# Altium project Apalis-Smart-Vision-Baseboard-Rev.1.2.1.PrjPcb (part 1 of 2)
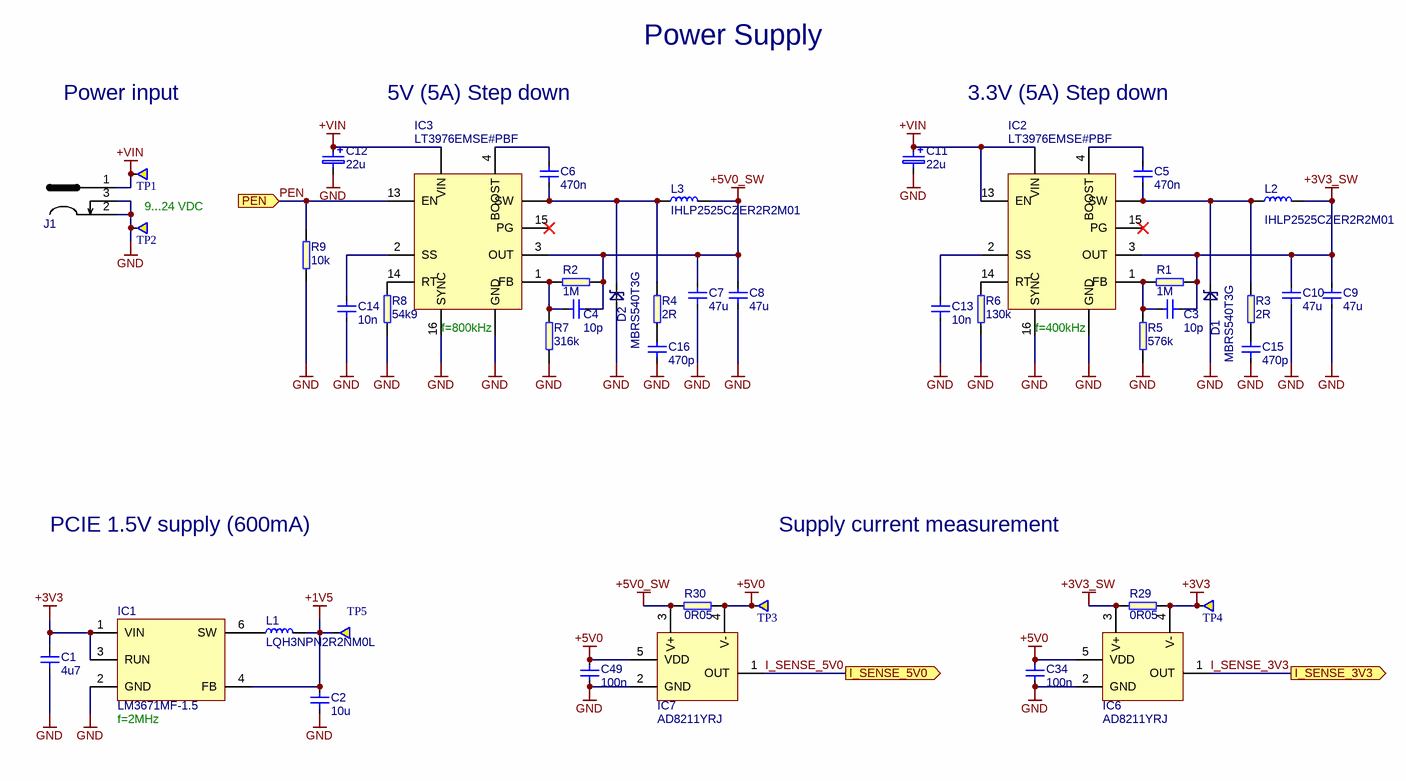
[diagram p0: Power-Supply.SchDoc]
AM_Title: Apalis Smart Vision Baseboard; AM_Status: OSHW; AM_Revision: 1.2.1
9 sheets, 202 parts. Net scope: global (net labels, ports and power ports of the same name join across sheets).
Board file: Apalis-Smart-Vision-Baseboard.PcbDoc
Sheets:
  Power-Supply.SchDoc
  SoM-Supply.SchDoc
  SoM-HighSpeed.SchDoc
  SoM-LowSpeed.SchDoc
  PCIe-SATA.SchDoc
  Debug-UART.SchDoc
  Camera-Interface.SchDoc
  Peripherals.SchDoc
  Interfaces.SchDoc

## Sheet Power-Supply.SchDoc
size A3; DocumentNumber: 1; SheetNumber: 1; SheetTotal: 9; PageSetup: Record=PageOptions|CenterHorizontal=True|CenterVertical=True|PrintScale=0.97|XCorrection=1.00|YCorrection=1.00|PrintKind=1|BorderSize=5000000|LeftOffset=0|BottomOffset=0|Orientation=2|PaperLength=2970|PaperWidth=2100|Scale=100|PaperSource=7|PrintQuality=600|MediaType=1|DitherType=10|PaperKind=A4|PrintScaleMode=1

### Parts
C1  4u7  [0402]
C2  10u  [0603]
C3  10p  [0402]
C4  10p  [0402]
C5  470n  [0402]
C6  470n  [0402]
C7  47u  [1206]
C8  47u  [1206]
C9  47u  [1206]
C10  47u  [1206]
C11  22u  [KEMET_C]
C12  22u  [KEMET_C]
C13  10n  [0402]
C14  10n  [0402]
C15  470p  [0402]
C16  470p  [0402]
C34  100n  [0402]
C49  100n  [0402]
D1  MBRS540T3G  [SMC-403-03]
D2  MBRS540T3G  [SMC-403-03]
IC1  LM3671MF-1.5  [SOT23-5N]
IC2  LT3976EMSE#PBF  [LT3976EMSE]
IC3  LT3976EMSE#PBF  [LT3976EMSE]
IC6  AD8211YRJ  [SOT23-5]
IC7  AD8211YRJ  [SOT23-5]
J1  694106106102  [694106106102]  (value not drawn)
L1  LQH3NPN2R2NM0L  [LQH3NPN2R2NM]
L2  IHLP2525CZER2R2M01  [IHLP-2525CZ-01]
L3  IHLP2525CZER2R2M01  [IHLP-2525CZ-01]
R1  1M  [0402]
R2  1M  [0402]
R3  2R  [0402]
R4  2R  [0402]
R5  576k  [0402]
R6  130k  [0402]
R7  316k  [0402]
R8  54k9  [0402]
R9  10k  [0402]
R29  0R05  [1206]
R30  0R05  [1206]
TP1  TP-R-1.5  [TP-R-1.5]  (value not drawn)  (no BOM)
TP2  TP-R-1.5  [TP-R-1.5]  (value not drawn)  (no BOM)
TP3  TP-R-1.5  [TP-R-1.5]  (value not drawn)  (no BOM)
TP4  TP-R-1.5  [TP-R-1.5]  (value not drawn)  (no BOM)
TP5  TP-R-1.5  [TP-R-1.5]  (value not drawn)  (no BOM)

### Ports
I_SENSE_3V3 (out), I_SENSE_5V0 (out), PEN (in)

### Nets
+1V5: C2.2 IC1.4(FB) L1.2 TP5.1
+3V3: C1.2 IC1.1(VIN) IC1.3(RUN) IC6.4(V-) R29.1 TP4.1
+3V3_SW: C3.1 C9.2 C10.2 IC2.3(OUT) IC6.3(V+) L2.2 R1.1 R29.2
+5V0: C34.1 C49.1 IC6.5(VDD) IC7.4(V-) IC7.5(VDD) R30.1 TP3.1
+5V0_SW: C4.1 C7.2 C8.2 IC3.3(OUT) IC7.3(V+) L3.2 R2.1 R30.2
+VIN: C11.1 C12.1 IC2.13(EN) IC2.VIN IC3.VIN J1.1 TP1.1
GND: C1.1 C2.1 C7.1 C8.1 C9.1 C10.1 C11.2 C12.2 C13.1 C14.1 C15.1 C16.1 C34.2 C49.2 D1.A D2.A IC1.2(GND) IC2.16(SYNC) IC2.GND IC3.16(SYNC) IC3.GND IC6.2(GND) IC7.2(GND) J1.2 J1.3 R5.1 R6.1 R7.1 R8.1 R9.1 TP2.1
I_SENSE_3V3: IC6.1(OUT) ; port I_SENSE_3V3
I_SENSE_5V0: IC7.1(OUT) ; port I_SENSE_5V0
PEN: IC3.13(EN) R9.2 ; port PEN
NetC3_2: C3.2 IC2.1(FB) R1.2 R5.2
NetC4_2: C4.2 IC3.1(FB) R2.2 R7.2
NetC5_1: C5.1 D1.C IC2.SW L2.1 R3.2
NetC5_2: C5.2 IC2.4(BOOST)
NetC6_1: C6.1 D2.C IC3.SW L3.1 R4.2
NetC6_2: C6.2 IC3.4(BOOST)
NetC13_2: C13.2 IC2.2(SS)
NetC14_2: C14.2 IC3.2(SS)
NetC15_2: C15.2 R3.1
NetC16_2: C16.2 R4.1
NetIC1_6: IC1.6(SW) L1.1
NetIC2_14: IC2.14(RT) R6.2
NetIC3_14: IC3.14(RT) R8.2

Not connected (* = marked no-connect by the designer): IC2 15(PG)*; IC3 15(PG)*

### Notes on the sheet
- Power Supply
- Power input
- 5V (5A) Step down
- 3.3V (5A) Step down
- (near TP2) 9...24 VDC
- (near IC3) f=800kHz
- (near IC2) f=400kHz
- PCIE 1.5V supply (600mA)
- Supply current measurement
- (near IC1) f=2MHz
- Title:
- Size:
- Date:
- A3
- Revision:
- Page:
- of
- Antmicro Ltd.
- File:
- www.antmicro.com

### Library data of the parts
C1 = C_4u7_0402: MLCC SMT Capacitor 4.7uF 0402; Manufacturer: MURATA; Part Symbol: GRM155R60G475ME; Value: 4u7; Part Number: C_4u7_0402; MPN: GRM155R60G475ME
C2 = C_10u_0603: MLCC SMT Capacitor 10uF 0603; Manufacturer: Walsin; Part Symbol: 0603X106M6R3CT; Value: 10u; Part Number: C_10u_0603; MPN: 0603X106M6R3CT
C3 C4 = C_10p_0402: MLCC SMT Capacitor 10pF 0402; Manufacturer: MULTICOMP; Part Symbol: MC0402N100D500CT; Value: 10p; Part Number: C_10p_0402; MPN: MC0402N100D500CT
C5 C6 = C_470n_0402: MLCC SMT Capacitor 470n 0402; Manufacturer: TDK; Part Symbol: MC0402X474K6R3CT; Value: 470n; Part Number: C_470n_0402; MPN: MC0402X474K6R3CT
C7-C10 = C_47u_1206: MLCC SMT Capacitor 47uF 1206; Manufacturer: MURATA; Part Symbol: GRM31CC80J476KE18L; Value: 47u; Part Number: C_47u_1206; MPN: GRM31CC80J476KE18L
C11 C12 = C_22u_KEMET_C: Tantalum SMT Capacitor 22uF Case KEMET_C; Manufacturer: KEMET; Part Symbol: T491C226K025AT; Value: 22u; Part Number: C_22u_KEMET_C; MPN: T491C226K025AT
C13 C14 = C_10n_0402: MLCC SMT Capacitor 10 nF 0402; Manufacturer: AVX; Part Symbol: 04025G103ZAT2A; Value: 10n; Part Number: C_10n_0402; MPN: 04025G103ZAT2A
C15 C16 = C_470p_0402: MLCC SMT Capacitor 470pF 0402; Manufacturer: MULTICOMP; Part Symbol: MC0402B471J500CT; Value: 470p; Part Number: C_470p_0402; MPN: MC0402B471J500CT
C34 C49 = C_100n_0402: MLCC SMT Capacitor 100n 0402; Manufacturer: TDK; Part Symbol: C1005X5R0J104K050BA; Value: 100n; Part Number: C_100n_0402; MPN: C1005X5R0J104K050BA
D1 D2 = MBRS540T3G: ON SEMICONDUCTOR  MBRS540T3G  Rectifier Diode, Single, 40 V, 5 A, 500 mV, 190 A, 150 °C; Part Number: MBRS540T3G; Value: MBRS540T3G; Manufacturer: ON SEMICONDUCTOR; Part Symbol: MBRS540T3G; MPN: MBRS540T3G
IC1 = LM3671: DC/DC Buck Converter; Manufacturer: TEXAS INSTRUMENTS; Part Symbol: LM3671MF-1.5/NOPB; Part Number: LM3671MF-1.5; Value: LM3671MF-1.5; MPN: LM3671MF-1.5/NOPB
IC2 IC3 = LT3976: LINEAR TECHNOLOGY  LT3976EMSE#PBF  DC-DC CONVERTER, 2MHZ, 5A, MSOP-16; Part Number: LT3976EMSE#PBF; Value: LT3976EMSE#PBF; Manufacturer: LINEAR TECHNOLOGY; Part Symbol: LT3976EMSE#PBF; MPN: LT3976EMSE#PBF
IC6 IC7 = AD8211YRJ: Current Sense Amplifier, High Voltage, 1 Amplifier, SOT-23, 5 Pins, -40 °C, 125 °C; Manufacturer: ANALOG DEVICES; Part Symbol: AD8211YRJ; Value: AD8211YRJ; MPN: AD8211YRJ
J1 = DC_SOCKET_2: DC Power Jack Right Angled SMT with 4 soldering pads & pegs WR-DC; Part Number: WE-694106106102; Manufacturer: WURTH ELEKTRONIK; Value: 694106106102; Part Symbol: 694106106102; MPN: 694106106102
L1 = LQH3NPN2R2NM0L: INDUCTOR, 2.2 µH, ± 30%, 1212, 90 MHz, 0.073 ohm; Manufacturer: MURATA; Value: LQH3NPN2R2NM0L; Part Number: LQH3NPN2R2NM0L; Part Symbol: LQH3NPN2R2NM0L; MPN: LQH3NPN2R2NM0L
L2 L3 = Inductor SMT: VISHAY DALE  IHLP2525CZER3R3M01  Surface Mount Power Inductor, IHLP-2525CZ-01 Series, 3.3 uH,  20%, Shielded, 0.03 ohm, 6 A; Part Number: IHLP2525CZER2R2M01; Value: IHLP2525CZER2R2M01; Manufacturer: VISHAY; Part Symbol: IHLP2525CZER3R3M01; MPN: IHLP2525CZER3R3M01
R1 R2 = R_1M_0402: RES, 1M, 0402; Manufacturer: VISHAY; Part Symbol: CRCW04021M00FKED; Value: 1M; Part Number: R_1M_0402; MPN: CRCW04021M00FKED
R3 R4 = R_2R_0402: RES, 2R, 0402; Manufacturer: YAGEO; Part Symbol: MC00625W040212R0; Value: 2R; Part Number: R_2R_0402; MPN: MC00625W040212R0
R5 = R_576k_0402: RES, 576k, 0402; Manufacturer: MULTICOMP; Part Symbol: MCMR04X5763FTL; Value: 576k; Part Number: R_576k_0402; MPN: MCMR04X5763FTL
R6 = R_130k_0402: RES, 130k, 0402; Manufacturer: MULTICOMP; Part Symbol: MCMR04X1303FTL; Value: 130k; Part Number: R_130k_0402; MPN: MCMR04X1303FTL
R7 = R_316k_0402: RES, 316k, 0402; Manufacturer: VISHAY; Part Symbol: CRCW0402316KFKED; Value: 316k; Part Number: R_316k_0402; MPN: CRCW0402316KFKED
R8 = R_54k9_0402: RES, 54k9, 0402; Manufacturer: MULTICOMP; Part Symbol: MCMR04X5492FTL; Value: 54k9; Part Number: R_54k9_0402; MPN: MCMR04X5492FTL
R9 = R_10k_0402: RES, 10k, 0402; Manufacturer: MULTICOMP; Part Symbol: MCMR04X1002FTL; Value: 10k; Part Number: R_10k_0402; MPN: MCMR04X1002FTL
R29 R30 = R_0R05_1206: RES, 0R05, 1206; Manufacturer: PANASONIC; Part Symbol: ERJL08KF50MV; Value: 0R05; Part Number: R_0R05_1206; MPN: ERJL08KF50MV
TP1-TP5 = TP-R-1.5: Testpad, round, 1.5mm; Part Number: TP-R-1.5

## Sheet SoM-Supply.SchDoc
size A3; DocumentNumber: 2; SheetNumber: 2; SheetTotal: 9; PageSetup: Record=PageOptions|CenterHorizontal=True|CenterVertical=True|PrintScale=0.97|XCorrection=1.00|YCorrection=1.00|PrintKind=1|BorderSize=5000000|LeftOffset=0|BottomOffset=0|Orientation=2|PaperLength=2970|PaperWidth=2100|Scale=100|PaperSource=7|PrintQuality=600|MediaType=1|DitherType=10|PaperKind=A4|PrintScaleMode=1
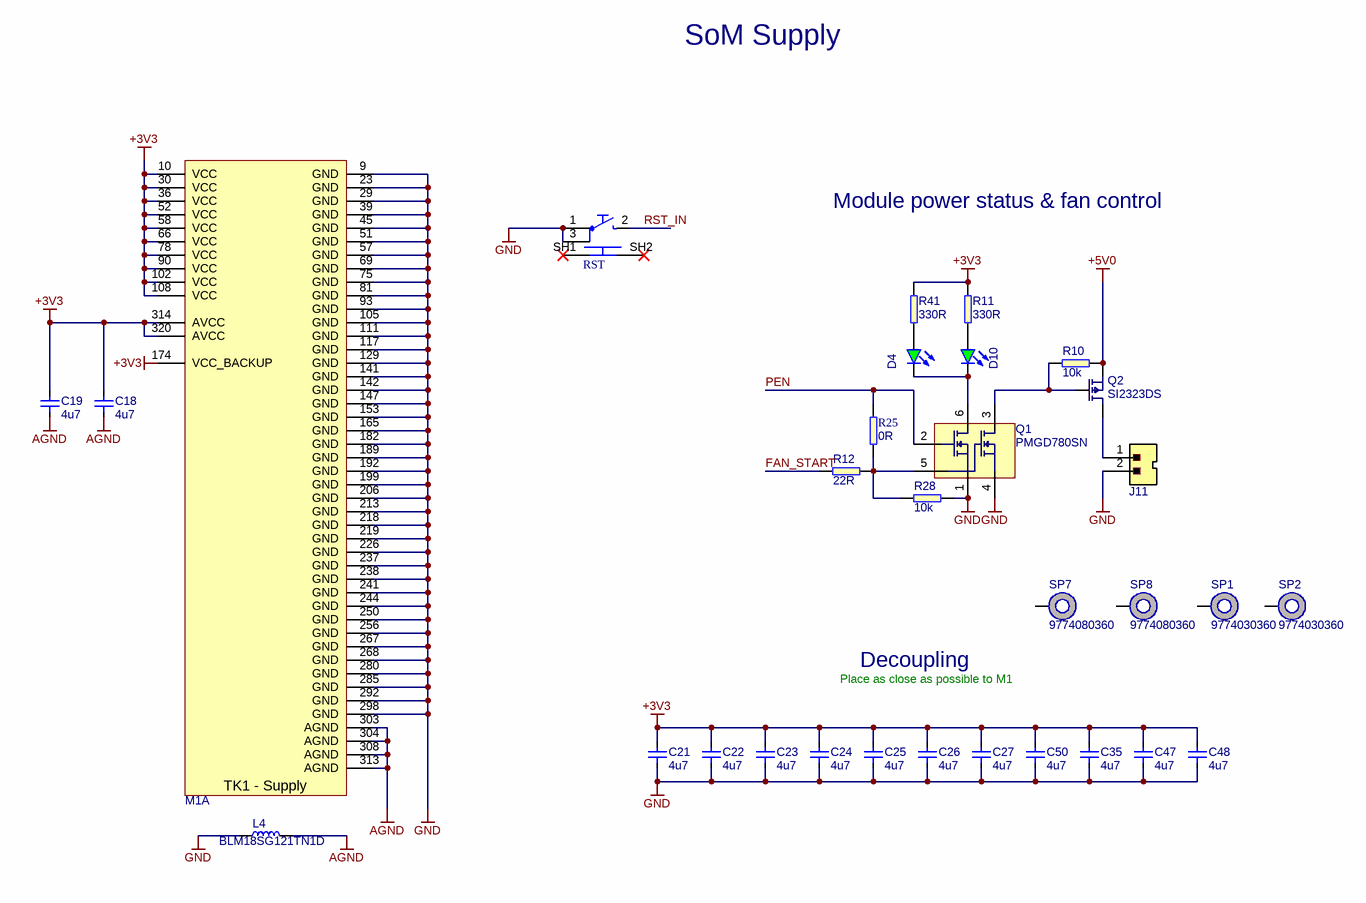
[diagram p1: SoM-Supply.SchDoc]

### Parts
C18  4u7  [0603]
C19  4u7  [0603]
C21  4u7  [0603]
C22  4u7  [0603]
C23  4u7  [0603]
C24  4u7  [0603]
C25  4u7  [0603]
C26  4u7  [0603]
C27  4u7  [0603]
C35  4u7  [0603]
C47  4u7  [0603]
C48  4u7  [0603]
C50  4u7  [0603]
D4  KPT-1608SGC  [LED0603]  (value not drawn)
D10  KPT-1608SGC  [LED0603]  (value not drawn)
J11  MX-22-23-2021  [molex_2223-2021]  (value not drawn)
L4  BLM18SG121TN1D  [0603]
M1  MM70-314-310B1  [Apalis-H]  (value not drawn)  (part A of 25)
Q1  PMGD780SN  [SOT-363]
Q2  SI2323DS  [SOT-23]
R10  10k  [0402]
R11  330R  [0402]
R12  22R  [0402]
R25  0R  [0402]
R28  10k  [0402]
R41  330R  [0402]
RST  TL3340AF160QG  [TL3340AF160QG]  (value not drawn)
SP1  9774030360  [M3-3mm]
SP2  9774030360  [M3-3mm]
SP7  9774080360  [M3-8mm]
SP8  9774080360  [M3-8mm]

### Nets
+3V3: C18.2 C19.2 C21.2 C22.2 C23.2 C24.2 C25.2 C26.2 C27.2 C35.2 C47.2 C48.2 C50.2 M1.10(VCC) M1.30(VCC) M1.36(VCC) M1.52(VCC) M1.58(VCC) M1.66(VCC) M1.78(VCC) M1.90(VCC) M1.102(VCC) M1.108(VCC) M1.174(VCC_BACKUP) M1.314(AVCC) M1.320(AVCC) R11.2 R41.2
+5V0: Q2.2(S) R10.2
AGND: C18.1 C19.1 L4.2 M1.303(AGND) M1.304(AGND) M1.308(AGND) M1.313(AGND)
GND: C21.1 C22.1 C23.1 C24.1 C25.1 C26.1 C27.1 C35.1 C47.1 C48.1 C50.1 J11.2 L4.1 M1.9(GND) M1.23(GND) M1.29(GND) M1.39(GND) M1.45(GND) M1.51(GND) M1.57(GND) M1.69(GND) M1.75(GND) M1.81(GND) M1.93(GND) M1.105(GND) M1.111(GND) M1.117(GND) M1.129(GND) M1.141(GND) M1.142(GND) M1.147(GND) M1.153(GND) M1.165(GND) M1.182(GND) M1.189(GND) M1.192(GND) M1.199(GND) M1.206(GND) M1.213(GND) M1.218(GND) M1.219(GND) M1.226(GND) M1.237(GND) M1.238(GND) M1.241(GND) M1.244(GND) M1.250(GND) M1.256(GND) M1.267(GND) M1.268(GND) M1.280(GND) M1.285(GND) M1.292(GND) M1.298(GND) Q1.1(S1) Q1.4(S2) R28.2 RST.1 RST.3
FAN_START: R12.1
PEN: Q1.2(G1) R25.2
RST_IN: RST.2
NetD4_A: D4.A R41.1
NetD4_K: D4.K D10.K Q1.6(D1)
NetD10_A: D10.A R11.1
NetJ11_1: J11.1 Q2.3(D)
NetQ1_3: Q1.3(D2) Q2.1(G) R10.1
NetQ1_5: Q1.5(G2) R12.2 R25.1 R28.1

Not connected (* = marked no-connect by the designer): RST SH1* SH2*; SP1 1; SP2 1; SP7 1; SP8 1

### Notes on the sheet
- SoM Supply
- Module power status & fan control
- Place as close as possible to M1
- Decoupling
- Title:
- Size:
- Date:
- A3
- Revision:
- Page:
- of
- Antmicro Ltd.
- File:
- www.antmicro.com
- (in symbol Apalis-TK1-H, part A) TK1 - Supply

### Library data of the parts
C18 C19 C21-C27 C35 C47 C48 C50 = C_4u7_0603: MLCC SMT Capacitor 4.7uF 0603; Manufacturer: MULTICOMP; Part Symbol: MC0603X475K6R3CT; Value: 4u7; Part Number: C_4u7_0603; MPN: MC0603X475K6R3CT
D4 D10 = LED_G: LED Green 0603 case; Manufacturer: KINGBRIGHT; Part Number: LED_G; Value: KPT-1608SGC; Part Symbol: KPT-1608SGC; MPN: KPT-1608SGC
J11 = molex_2223-2021: Pinhead connector with key; Manufacturer: Molex; Part Symbol: 022232021 A-6373-02A222; Part Number: molex_2223-2021; Value: MX-22-23-2021; MPN: 022232021 A-6373-02A222
L4 = BLM18SG121TN1D: FERRITE BEAD, 0.025OHM, 3A, 0603; Manufacturer: MURATA; Part Number: BLM18SG121TN1D; Value: BLM18SG121TN1D; Part Symbol: BLM18SG121TN1D; MPN: BLM18SG121TN1D
M1 = Apalis-TK1-H: Toradex Apalis TK1, Horizontal; Manufacturer: JAE Electronics; Part Number: Apalis-TK1-H; Part Symbol: MM70-314-310B1; Value: MM70-314-310B1; MPN: MM70-314-310B1
Q1 = PMGD780SN: 60 V, dual N-channel Trench MOSFET; Manufacturer: NXP; Part Symbol: PMGD780SN,115; Part Number: PMGD780SN; Value: PMGD780SN; MPN: PMGD780SN,115
Q2 = PMOS: pMOS 4.7A 20V; Manufacturer: Vishay; Part Symbol: SI2323DS-T1-E3; Part Number: SI2323DS; Value: SI2323DS; MPN: SI2323DS-T1-E3
R10 R28 = R_10k_0402: as R9 on sheet Power-Supply; Value: 10k; Part Number: R_10k_0402; MPN: MCMR04X1002FTL
R11 R41 = R_330R_0402: RES, 330R, 0402; Manufacturer: MULTICOMP; Part Symbol: MCMR04X3300FTL; Value: 330R; Part Number: R_330R_0402; MPN: MCMR04X3300FTL
R12 = R_22R_0402: RES, 22R, 0402; Manufacturer: VISHAY; Part Symbol: CRCW040222R0FKED; Value: 22R; Part Number: R_22R_0402; MPN: CRCW040222R0FKED
R25 = R_0R_0402: RES, 0R, 0402; Manufacturer: Panasonic; Part Symbol: ERJ2GE0R00X; Value: 0R; Part Number: R_0R_0402; MPN: ERJ2GE0R00X
RST = TL3340AF160QG: E-SWITCH  TL3340AF160QG  SWITCH, TACTILE SPST 50mA, SMD GULL WING; Part Number: TL3340AF160QG; Value: TL3340AF160QG; Manufacturer: E-SWITCH; Part Symbol: TL3340AF160QG; MPN: TL3340AF160QG
SP1 SP2 = WE_9774030360: M3x3; Manufacturer: WURTH ELEKTRONIK; Part Number: WE_9774030360; Value: 9774030360; Part Symbol: 9774030360; MPN: 9774030360
SP7 SP8 = M3x8: M2.5x5; Manufacturer: WURTH ELEKTRONIK; Part Number: 9774080360; Value: 9774080360; Part Symbol: 9774080360; MPN: 9774080360

## Sheet SoM-HighSpeed.SchDoc
size A3; DocumentNumber: 3; SheetNumber: 3; SheetTotal: 9; PageSetup: Record=PageOptions|CenterHorizontal=True|CenterVertical=True|PrintScale=0.97|XCorrection=1.00|YCorrection=1.00|PrintKind=1|BorderSize=5000000|LeftOffset=0|BottomOffset=0|Orientation=2|PaperLength=2970|PaperWidth=2100|Scale=100|PaperSource=7|PrintQuality=600|MediaType=1|DitherType=10|PaperKind=A4|PrintScaleMode=1
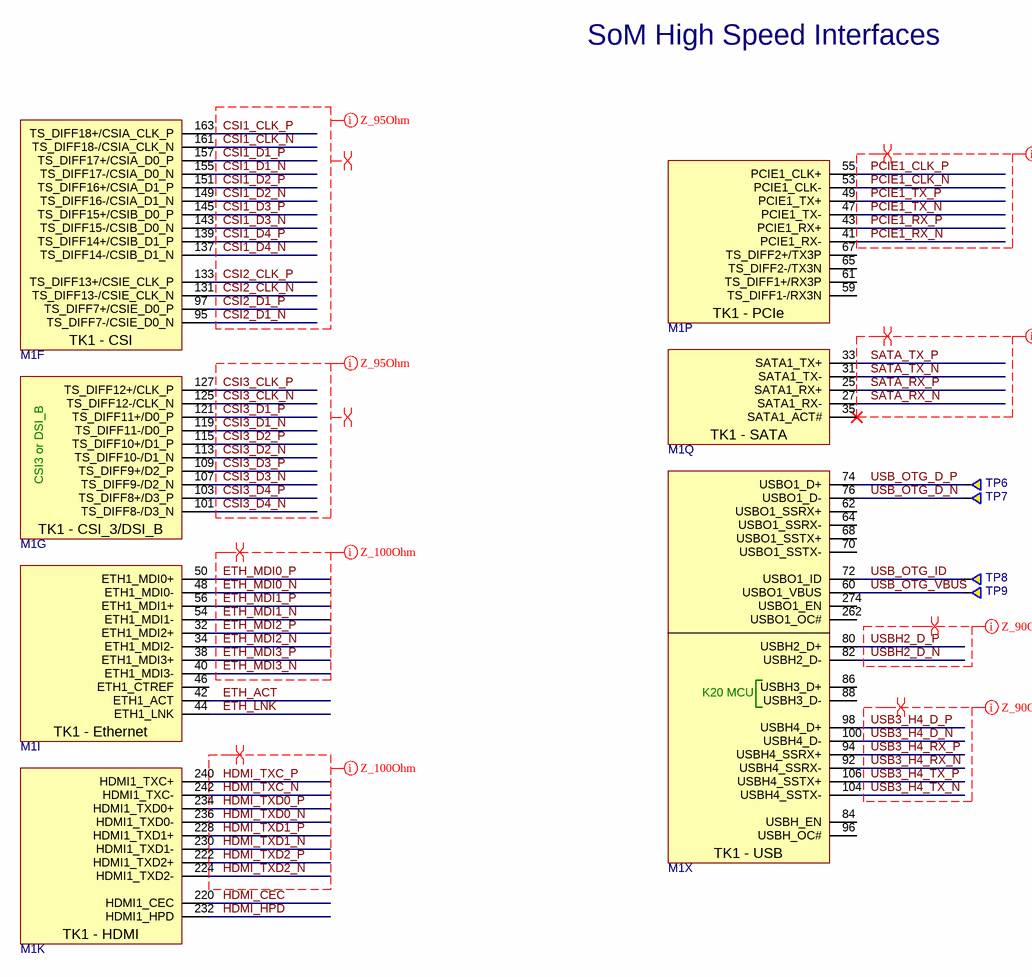
[diagram p2: SoM-HighSpeed.SchDoc]

### Parts
M1  MM70-314-310B1  [Apalis-H]  (value not drawn)  (parts F,G,I,K,P,Q,X of 25)
TP6  TP-R-1.5  [TP-R-1.5]  (value not drawn)  (no BOM)
TP7  TP-R-1.5  [TP-R-1.5]  (value not drawn)  (no BOM)
TP8  TP-R-1.5  [TP-R-1.5]  (value not drawn)  (no BOM)
TP9  TP-R-1.5  [TP-R-1.5]  (value not drawn)  (no BOM)

### Nets
USB_OTG_VBUS: M1.60(USBO1_VBUS) TP9.1
CSI1_CLK_N: M1.161(TS_DIFF18-/CSIA_CLK_N)
CSI1_CLK_P: M1.163(TS_DIFF18+/CSIA_CLK_P)
CSI1_D1_N: M1.155(TS_DIFF17-/CSIA_D0_N)
CSI1_D1_P: M1.157(TS_DIFF17+/CSIA_D0_P)
CSI1_D2_N: M1.149(TS_DIFF16-/CSIA_D1_N)
CSI1_D2_P: M1.151(TS_DIFF16+/CSIA_D1_P)
CSI1_D3_N: M1.143(TS_DIFF15-/CSIB_D0_N)
CSI1_D3_P: M1.145(TS_DIFF15+/CSIB_D0_P)
CSI1_D4_N: M1.137(TS_DIFF14-/CSIB_D1_N)
CSI1_D4_P: M1.139(TS_DIFF14+/CSIB_D1_P)
CSI2_CLK_N: M1.131(TS_DIFF13-/CSIE_CLK_N)
CSI2_CLK_P: M1.133(TS_DIFF13+/CSIE_CLK_P)
CSI2_D1_N: M1.95(TS_DIFF7-/CSIE_D0_N)
CSI2_D1_P: M1.97(TS_DIFF7+/CSIE_D0_P)
CSI3_CLK_N: M1.125(TS_DIFF12-/CLK_N)
CSI3_CLK_P: M1.127(TS_DIFF12+/CLK_P)
CSI3_D1_N: M1.119(TS_DIFF11-/D0_P)
CSI3_D1_P: M1.121(TS_DIFF11+/D0_P)
CSI3_D2_N: M1.113(TS_DIFF10-/D1_N)
CSI3_D2_P: M1.115(TS_DIFF10+/D1_P)
CSI3_D3_N: M1.107(TS_DIFF9-/D2_N)
CSI3_D3_P: M1.109(TS_DIFF9+/D2_P)
CSI3_D4_N: M1.101(TS_DIFF8-/D3_N)
CSI3_D4_P: M1.103(TS_DIFF8+/D3_P)
ETH_ACT: M1.42(ETH1_ACT)
ETH_LNK: M1.44(ETH1_LNK)
ETH_MDI0_N: M1.48(ETH1_MDI0-)
ETH_MDI0_P: M1.50(ETH1_MDI0+)
ETH_MDI1_N: M1.54(ETH1_MDI1-)
ETH_MDI1_P: M1.56(ETH1_MDI1+)
ETH_MDI2_N: M1.34(ETH1_MDI2-)
ETH_MDI2_P: M1.32(ETH1_MDI2+)
ETH_MDI3_N: M1.40(ETH1_MDI3-)
ETH_MDI3_P: M1.38(ETH1_MDI3+)
HDMI_CEC: M1.220(HDMI1_CEC)
HDMI_HPD: M1.232(HDMI1_HPD)
HDMI_TXC_N: M1.242(HDMI1_TXC-)
HDMI_TXC_P: M1.240(HDMI1_TXC+)
HDMI_TXD0_N: M1.236(HDMI1_TXD0-)
HDMI_TXD0_P: M1.234(HDMI1_TXD0+)
HDMI_TXD1_N: M1.230(HDMI1_TXD1-)
HDMI_TXD1_P: M1.228(HDMI1_TXD1+)
HDMI_TXD2_N: M1.224(HDMI1_TXD2-)
HDMI_TXD2_P: M1.222(HDMI1_TXD2+)
PCIE1_CLK_N: M1.53(PCIE1_CLK-)
PCIE1_CLK_P: M1.55(PCIE1_CLK+)
PCIE1_RX_N: M1.41(PCIE1_RX-)
PCIE1_RX_P: M1.43(PCIE1_RX+)
PCIE1_TX_N: M1.47(PCIE1_TX-)
PCIE1_TX_P: M1.49(PCIE1_TX+)
SATA_RX_N: M1.27(SATA1_RX-)
SATA_RX_P: M1.25(SATA1_RX+)
SATA_TX_N: M1.31(SATA1_TX-)
SATA_TX_P: M1.33(SATA1_TX+)
USB3_H4_D_N: M1.100(USBH4_D-)
USB3_H4_D_P: M1.98(USBH4_D+)
USB3_H4_RX_N: M1.92(USBH4_SSRX-)
USB3_H4_RX_P: M1.94(USBH4_SSRX+)
USB3_H4_TX_N: M1.104(USBH4_SSTX-)
USB3_H4_TX_P: M1.106(USBH4_SSTX+)
USB_OTG_D_N: M1.76(USBO1_D-) TP7.1
USB_OTG_D_P: M1.74(USBO1_D+) TP6.1
USB_OTG_ID: M1.72(USBO1_ID) TP8.1
USBH2_D_N: M1.82(USBH2_D-)
USBH2_D_P: M1.80(USBH2_D+)

Not connected (* = marked no-connect by the designer): M1 35(SATA1_ACT#)* 46(ETH1_CTREF) 59(TS_DIFF1-/RX3N) 61(TS_DIFF1+/RX3P) 62(USBO1_SSRX+) 64(USBO1_SSRX-) 65(TS_DIFF2-/TX3N) 67(TS_DIFF2+/TX3P) 68(USBO1_SSTX+) 70(USBO1_SSTX-) 84(USBH_EN) 86(USBH3_D+) 88(USBH3_D-) 96(USBH_OC#) 262(USBO1_OC#) 274(USBO1_EN)

### Layout directives
differential pair: CSI1_CLK_N, CSI1_CLK_P, CSI1_D1_N, CSI1_D1_P, CSI1_D2_N, CSI1_D2_P, CSI1_D3_N, CSI1_D3_P, CSI1_D4_N, CSI1_D4_P, CSI2_CLK_N, CSI2_CLK_P, CSI2_D1_N, CSI2_D1_P, CSI3_CLK_N, CSI3_CLK_P, CSI3_D1_N, CSI3_D1_P, CSI3_D2_N, CSI3_D2_P, CSI3_D3_N, CSI3_D3_P, CSI3_D4_N, CSI3_D4_P, ETH_MDI0_N, ETH_MDI0_P, ETH_MDI1_N, ETH_MDI1_P, ETH_MDI2_N, ETH_MDI2_P, ETH_MDI3_N, ETH_MDI3_P, HDMI_TXC_N, HDMI_TXC_P, HDMI_TXD0_N, HDMI_TXD0_P, HDMI_TXD1_N, HDMI_TXD1_P, HDMI_TXD2_N, HDMI_TXD2_P, PCIE1_CLK_N, PCIE1_CLK_P, PCIE1_RX_N, PCIE1_RX_P, PCIE1_TX_N, PCIE1_TX_P, SATA_RX_N, SATA_RX_P, SATA_TX_N, SATA_TX_P, USB3_H4_D_N, USB3_H4_D_P, USB3_H4_RX_N, USB3_H4_RX_P, USB3_H4_TX_N, USB3_H4_TX_P, USBH2_D_N, USBH2_D_P
net class Z_95Ohm: CSI1_CLK_N, CSI1_CLK_P, CSI1_D1_N, CSI1_D1_P, CSI1_D2_N, CSI1_D2_P, CSI1_D3_N, CSI1_D3_P, CSI1_D4_N, CSI1_D4_P, CSI2_CLK_N, CSI2_CLK_P, CSI2_D1_N, CSI2_D1_P, CSI3_CLK_N, CSI3_CLK_P, CSI3_D1_N, CSI3_D1_P, CSI3_D2_N, CSI3_D2_P, CSI3_D3_N, CSI3_D3_P, CSI3_D4_N, CSI3_D4_P, USB3_H4_D_N, USB3_H4_D_P, USB3_H4_RX_N, USB3_H4_RX_P, USB3_H4_TX_N, USB3_H4_TX_P, USBH2_D_N, USBH2_D_P
net class Z_100Ohm: ETH_MDI0_N, ETH_MDI0_P, ETH_MDI1_N, ETH_MDI1_P, ETH_MDI2_N, ETH_MDI2_P, ETH_MDI3_N, ETH_MDI3_P, HDMI_TXC_N, HDMI_TXC_P, HDMI_TXD0_N, HDMI_TXD0_P, HDMI_TXD1_N, HDMI_TXD1_P, HDMI_TXD2_N, HDMI_TXD2_P, PCIE1_CLK_N, PCIE1_CLK_P, PCIE1_RX_N, PCIE1_RX_P, PCIE1_TX_N, PCIE1_TX_P, SATA_RX_N, SATA_RX_P, SATA_TX_N, SATA_TX_P

### Notes on the sheet
- SoM High Speed Interfaces
- Title:
- Size:
- Date:
- A3
- Revision:
- Page:
- of
- Antmicro Ltd.
- File:
- www.antmicro.com
- (in symbol Apalis-TK1-H, part F) TK1 - CSI
- (in symbol Apalis-TK1-H, part G) CSI3 or DSI_B; TK1 - CSI_3/DSI_B
- (in symbol Apalis-TK1-H, part I) TK1 - Ethernet
- (in symbol Apalis-TK1-H, part K) TK1 - HDMI
- (in symbol Apalis-TK1-H, part P) TK1 - PCIe
- (in symbol Apalis-TK1-H, part Q) TK1 - SATA
- (in symbol Apalis-TK1-H, part X) K20 MCU; TK1 - USB

### Library data of the parts
M1 = Apalis-TK1-H: as M1 on sheet SoM-Supply; Part Number: Apalis-TK1-H; Part Symbol: MM70-314-310B1; Value: MM70-314-310B1; MPN: MM70-314-310B1
TP6-TP9 = TP-R-1.5: Testpad, round, 1.5mm; Part Number: TP-R-1.5

## Sheet SoM-LowSpeed.SchDoc
size A3; DocumentNumber: 4; SheetNumber: 4; SheetTotal: 9; PageSetup: Record=PageOptions|CenterHorizontal=True|CenterVertical=True|PrintScale=0.97|XCorrection=1.00|YCorrection=1.00|PrintKind=1|BorderSize=5000000|LeftOffset=0|BottomOffset=0|Orientation=2|PaperLength=2970|PaperWidth=2100|Scale=100|PaperSource=7|PrintQuality=600|MediaType=1|DitherType=10|PaperKind=A4|PrintScaleMode=1
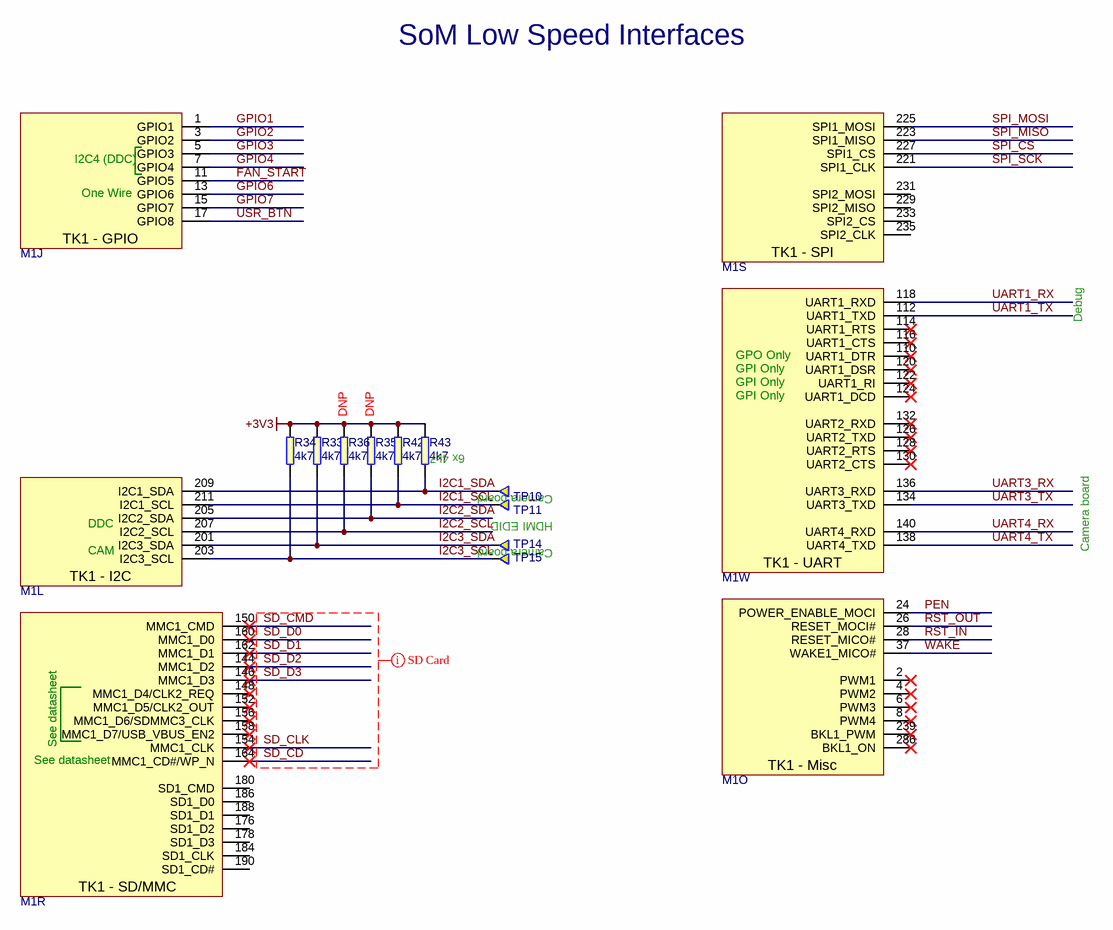
[diagram p3: SoM-LowSpeed.SchDoc]

### Parts
M1  MM70-314-310B1  [Apalis-H]  (value not drawn)  (parts J,L,O,R,S,W of 25)
R33  4k7  [0402]
R34  4k7  [0402]
R35  4k7  [0402]
R36  4k7  [0402]
R42  4k7  [0402]
R43  4k7  [0402]
TP10  TP-R-1.5  [TP-R-1.5]  (value not drawn)  (no BOM)
TP11  TP-R-1.5  [TP-R-1.5]  (value not drawn)  (no BOM)
TP14  TP-R-1.5  [TP-R-1.5]  (value not drawn)  (no BOM)
TP15  TP-R-1.5  [TP-R-1.5]  (value not drawn)  (no BOM)

### Nets
+3V3: R33.2 R34.2 R35.2 R36.2 R42.2 R43.2
FAN_START: M1.11(GPIO5)
GPIO1: M1.1(GPIO1)
GPIO2: M1.3(GPIO2)
GPIO3: M1.5(GPIO3)
GPIO4: M1.7(GPIO4)
GPIO6: M1.13(GPIO6)
GPIO7: M1.15(GPIO7)
I2C1_SCL: M1.211(I2C1_SCL) R42.1 TP11.1
I2C1_SDA: M1.209(I2C1_SDA) R43.1 TP10.1
I2C2_SCL: M1.207(I2C2_SCL) R36.1
I2C2_SDA: M1.205(I2C2_SDA) R35.1
I2C3_SCL: M1.203(I2C3_SCL) R34.1 TP15.1
I2C3_SDA: M1.201(I2C3_SDA) R33.1 TP14.1
PEN: M1.24(POWER_ENABLE_MOCI)
RST_IN: M1.28(RESET_MICO#)
RST_OUT: M1.26(RESET_MOCI#)
SD_CD: M1.164(MMC1_CD#/WP_N)
SD_CLK: M1.154(MMC1_CLK)
SD_CMD: M1.150(MMC1_CMD)
SD_D0: M1.160(MMC1_D0)
SD_D1: M1.162(MMC1_D1)
SD_D2: M1.144(MMC1_D2)
SD_D3: M1.146(MMC1_D3)
SPI_CS: M1.227(SPI1_CS)
SPI_MISO: M1.223(SPI1_MISO)
SPI_MOSI: M1.225(SPI1_MOSI)
SPI_SCK: M1.221(SPI1_CLK)
UART1_RX: M1.118(UART1_RXD)
UART1_TX: M1.112(UART1_TXD)
UART3_RX: M1.136(UART3_RXD)
UART3_TX: M1.134(UART3_TXD)
UART4_RX: M1.140(UART4_RXD)
UART4_TX: M1.138(UART4_TXD)
USR_BTN: M1.17(GPIO8)
WAKE: M1.37(WAKE1_MICO#)

Not connected (* = marked no-connect by the designer): M1 2(PWM1)* 4(PWM2)* 6(PWM3)* 8(PWM4)* 110(UART1_DTR)* 114(UART1_RTS)* 116(UART1_CTS)* 120(UART1_DSR)* 122(UART1_RI)* 124(UART1_DCD)* 126(UART2_TXD)* 128(UART2_RTS)* 130(UART2_CTS)* 132(UART2_RXD)* 148(MMC1_D4/CLK2_REQ)* 152(MMC1_D5/CLK2_OUT)* 156(MMC1_D6/SDMMC3_CLK)* 158(MMC1_D7/USB_VBUS_EN2)* 176(SD1_D2) 178(SD1_D3) 180(SD1_CMD) 184(SD1_CLK) 186(SD1_D0) 188(SD1_D1) 190(SD1_CD#) 229(SPI2_MISO) 231(SPI2_MOSI) 233(SPI2_CS) 235(SPI2_CLK) 239(BKL1_PWM)* 286(BKL1_ON)*

### Layout directives
net class SD: SD_CD, SD_CLK, SD_CMD, SD_D0, SD_D1, SD_D2, SD_D3

### Notes on the sheet
- SoM Low Speed Interfaces
- Debug
- DNP
- 6x 4k7
- Camera board
- HDMI EDID
- Title:
- Size:
- Date:
- A3
- Revision:
- Page:
- of
- Antmicro Ltd.
- File:
- www.antmicro.com
- (in symbol Apalis-TK1-H, part J) I2C4 (DDC); One Wire; TK1 - GPIO
- (in symbol Apalis-TK1-H, part L) DDC; CAM; TK1 - I2C
- (in symbol Apalis-TK1-H, part O) TK1 - Misc
- (in symbol Apalis-TK1-H, part R) See datasheet; TK1 - SD/MMC
- (in symbol Apalis-TK1-H, part S) TK1 - SPI
- (in symbol Apalis-TK1-H, part W) GPO Only; GPI Only; TK1 - UART

### Library data of the parts
M1 = Apalis-TK1-H: as M1 on sheet SoM-Supply; Part Number: Apalis-TK1-H; Part Symbol: MM70-314-310B1; Value: MM70-314-310B1; MPN: MM70-314-310B1
R33-R36 R42 R43 = R_4k7_0402: RES, 4k7, 0402; Manufacturer: Panasonic; Part Symbol: ERJ2GEJ472X; Value: 4k7; Part Number: R_4k7_0402; MPN: ERJ2GEJ472X
TP10 TP11 TP14 TP15 = TP-R-1.5: Testpad, round, 1.5mm; Part Number: TP-R-1.5

## Sheet PCIe-SATA.SchDoc
size A3; DocumentNumber: 5; SheetNumber: 5; SheetTotal: 9; PageSetup: Record=PageOptions|CenterHorizontal=True|CenterVertical=True|PrintScale=0.97|XCorrection=1.00|YCorrection=1.00|PrintKind=1|BorderSize=5000000|LeftOffset=0|BottomOffset=0|Orientation=2|PaperLength=2970|PaperWidth=2100|Scale=100|PaperSource=7|PrintQuality=600|MediaType=1|DitherType=10|PaperKind=A4|PrintScaleMode=1
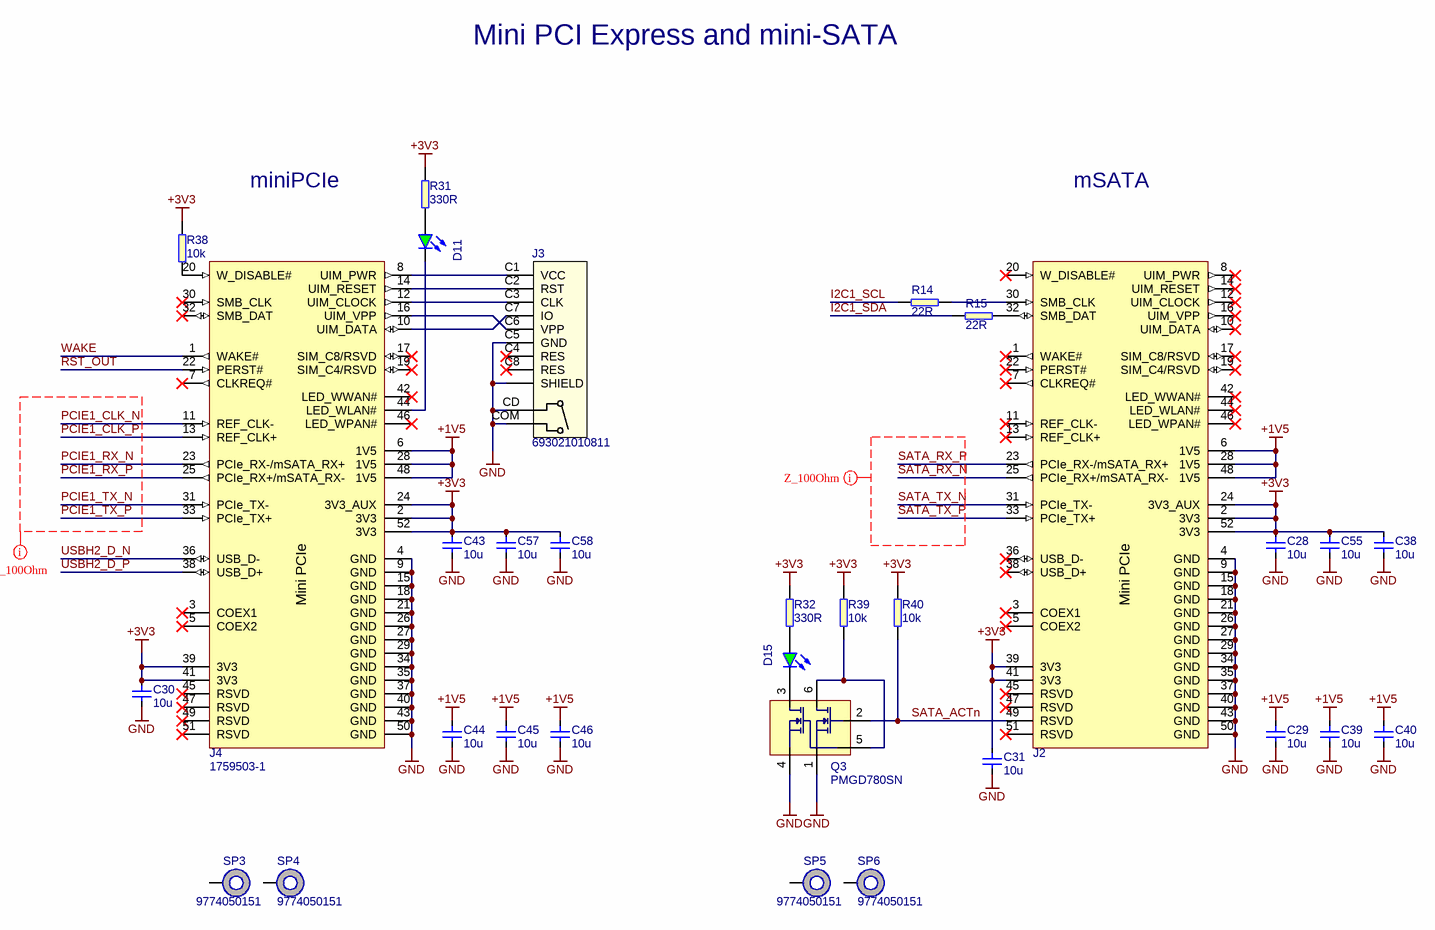
[diagram p4: PCIe-SATA.SchDoc]

### Parts
C28  10u  [0603]
C29  10u  [0603]
C30  10u  [0603]
C31  10u  [0603]
C38  10u  [0603]
C39  10u  [0603]
C40  10u  [0603]
C43  10u  [0603]
C44  10u  [0603]
C45  10u  [0603]
C46  10u  [0603]
C55  10u  [0603]
C57  10u  [0603]
C58  10u  [0603]
D11  KPT-1608SGC  [LED0603]  (value not drawn)
D15  KPT-1608SGC  [LED0603]  (value not drawn)
J2  1759503-1  [1759503-1]  (value not drawn)
J3  693021010811  [693021010811]
J4  1759503-1  [1759503-1]
Q3  PMGD780SN  [SOT-363]
R14  22R  [0402]
R15  22R  [0402]
R31  330R  [0402]
R32  330R  [0402]
R38  10k  [0402]
R39  10k  [0402]
R40  10k  [0402]
SP3  9774050151  [M2.5-5mm]
SP4  9774050151  [M2.5-5mm]
SP5  9774050151  [M2.5-5mm]
SP6  9774050151  [M2.5-5mm]

### Nets
+1V5: C29.1 C39.1 C40.1 C44.1 C45.1 C46.1 J2.6(1V5) J2.28(1V5) J2.48(1V5) J4.6(1V5) J4.28(1V5) J4.48(1V5)
+3V3: C28.1 C30.1 C31.1 C38.1 C43.1 C55.1 C57.1 C58.1 J2.2(3V3) J2.24(3V3_AUX) J2.39(3V3) J2.41(3V3) J2.52(3V3) J4.2(3V3) J4.24(3V3_AUX) J4.39(3V3) J4.41(3V3) J4.52(3V3) R31.2 R32.2 R38.2 R39.2 R40.2
GND: C28.2 C29.2 C30.2 C31.2 C38.2 C39.2 C40.2 C43.2 C44.2 C45.2 C46.2 C55.2 C57.2 C58.2 J2.4(GND) J2.9(GND) J2.15(GND) J2.18(GND) J2.21(GND) J2.26(GND) J2.27(GND) J2.29(GND) J2.34(GND) J2.35(GND) J2.37(GND) J2.40(GND) J2.43(GND) J2.50(GND) J3.C5(GND) J3.CD J3.COM J3.SHIELD J4.4(GND) J4.9(GND) J4.15(GND) J4.18(GND) J4.21(GND) J4.26(GND) J4.27(GND) J4.29(GND) J4.34(GND) J4.35(GND) J4.37(GND) J4.40(GND) J4.43(GND) J4.50(GND) Q3.1(S1) Q3.4(S2)
I2C1_SCL: R14.1
I2C1_SDA: R15.1
PCIE1_CLK_N: J4.11(REF_CLK-)
PCIE1_CLK_P: J4.13(REF_CLK+)
PCIE1_RX_N: J4.23(PCIe_RX-/mSATA_RX+)
PCIE1_RX_P: J4.25(PCIe_RX+/mSATA_RX-)
PCIE1_TX_N: J4.31(PCIe_TX-)
PCIE1_TX_P: J4.33(PCIe_TX+)
RST_OUT: J4.22(PERST#)
SATA_ACTn: J2.49(RSVD) Q3.2(G1) R40.1
SATA_RX_N: J2.25(PCIe_RX+/mSATA_RX-)
SATA_RX_P: J2.23(PCIe_RX-/mSATA_RX+)
SATA_TX_N: J2.31(PCIe_TX-)
SATA_TX_P: J2.33(PCIe_TX+)
USBH2_D_N: J4.36(USB_D-)
USBH2_D_P: J4.38(USB_D+)
WAKE: J4.1(WAKE#)
NetD11_A: D11.A R31.1
NetD11_K: D11.K J4.44(LED_WLAN#)
NetD15_A: D15.A R32.1
NetD15_K: D15.K Q3.3(D2)
NetJ2_30: J2.30(SMB_CLK) R14.2
NetJ2_32: J2.32(SMB_DAT) R15.2
NetJ3_C1: J3.C1(VCC) J4.8(UIM_PWR)
NetJ3_C2: J3.C2(RST) J4.14(UIM_RESET)
NetJ3_C3: J3.C3(CLK) J4.12(UIM_CLOCK)
NetJ3_C6: J3.C6(VPP) J4.16(UIM_VPP)
NetJ3_C7: J3.C7(IO) J4.10(UIM_DATA)
NetJ4_20: J4.20(W_DISABLE#) R38.1
NetQ3_5: Q3.5(G2) Q3.6(D1) R39.1

Not connected (* = marked no-connect by the designer): J2 1(WAKE#)* 3(COEX1)* 5(COEX2)* 7(CLKREQ#)* 8(UIM_PWR)* 10(UIM_DATA)* 11(REF_CLK-)* 12(UIM_CLOCK)* 13(REF_CLK+)* 14(UIM_RESET)* 16(UIM_VPP)* 17(SIM_C8/RSVD)* 19(SIM_C4/RSVD)* 20(W_DISABLE#)* 22(PERST#)* 36(USB_D-)* 38(USB_D+)* 42(LED_WWAN#)* 44(LED_WLAN#)* 45(RSVD)* 46(LED_WPAN#)* 47(RSVD)* 51(RSVD)*; J3 C4(RES)* C8(RES)*; J4 3(COEX1)* 5(COEX2)* 7(CLKREQ#)* 17(SIM_C8/RSVD)* 19(SIM_C4/RSVD)* 30(SMB_CLK)* 32(SMB_DAT)* 42(LED_WWAN#)* 45(RSVD)* 46(LED_WPAN#)* 47(RSVD)* 49(RSVD)* 51(RSVD)*; SP3 1; SP4 1; SP5 1; SP6 1

### Layout directives
net class Z_100Ohm: PCIE1_CLK_N, PCIE1_CLK_P, PCIE1_RX_N, PCIE1_RX_P, PCIE1_TX_N, PCIE1_TX_P, SATA_RX_N, SATA_RX_P, SATA_TX_N, SATA_TX_P

### Notes on the sheet
- Mini PCI Express and mini-SATA
- miniPCIe
- mSATA
- Title:
- Size:
- Date:
- A3
- Revision:
- Page:
- of
- Antmicro Ltd.
- File:
- www.antmicro.com
- (in symbol MiniPCIExpress) Mini PCIe

### Library data of the parts
C28-C31 C38-C40 C43-C46 C55 C57 C58 = C_10u_0603: as C2 on sheet Power-Supply; Value: 10u; Part Number: C_10u_0603; MPN: 0603X106M6R3CT
D11 D15 = LED_G: as D4 on sheet SoM-Supply; Part Number: LED_G; Value: KPT-1608SGC; Part Symbol: KPT-1608SGC; MPN: KPT-1608SGC
J2 J4 = MiniPCIExpress: Mini PCI Express 8mm; Part Number: TE-1759503-1; Manufacturer: TE CONNECTIVITY; Value: 1759503-1; Part Symbol: 1759503-1; MPN: 1759503-1
J3 = SIM-8P-CD: Micro SIM Card Connector WR-CRD, Push & Push - with Card Detection; Manufacturer: WURTH ELEKTRONIK; Part Number: WE-693-021-010-811; Value: 693021010811; Part Symbol: 693021010811; MPN: 693021010811
Q3 = PMGD780SN: as Q1 on sheet SoM-Supply; Part Number: PMGD780SN; Value: PMGD780SN; MPN: PMGD780SN,115
R14 R15 = R_22R_0402: as R12 on sheet SoM-Supply; Value: 22R; Part Number: R_22R_0402; MPN: CRCW040222R0FKED
R31 R32 = R_330R_0402: as R11 on sheet SoM-Supply; Value: 330R; Part Number: R_330R_0402; MPN: MCMR04X3300FTL
R38-R40 = R_10k_0402: as R9 on sheet Power-Supply; Value: 10k; Part Number: R_10k_0402; MPN: MCMR04X1002FTL
SP3-SP6 = M2.5x5: Manufacturer: WURTH ELEKTRONIK; Part Number: 9774050151; Value: 9774050151; Part Symbol: 9774050151; MPN: 9774050151

## Sheet Debug-UART.SchDoc
size A3; DocumentNumber: 6; SheetNumber: 6; SheetTotal: 9; PageSetup: Record=PageOptions|CenterHorizontal=True|CenterVertical=True|PrintScale=0.97|XCorrection=1.00|YCorrection=1.00|PrintKind=1|BorderSize=5000000|LeftOffset=0|BottomOffset=0|Orientation=2|PaperLength=2970|PaperWidth=2100|Scale=100|PaperSource=7|PrintQuality=600|MediaType=1|DitherType=10|PaperKind=A4|PrintScaleMode=1
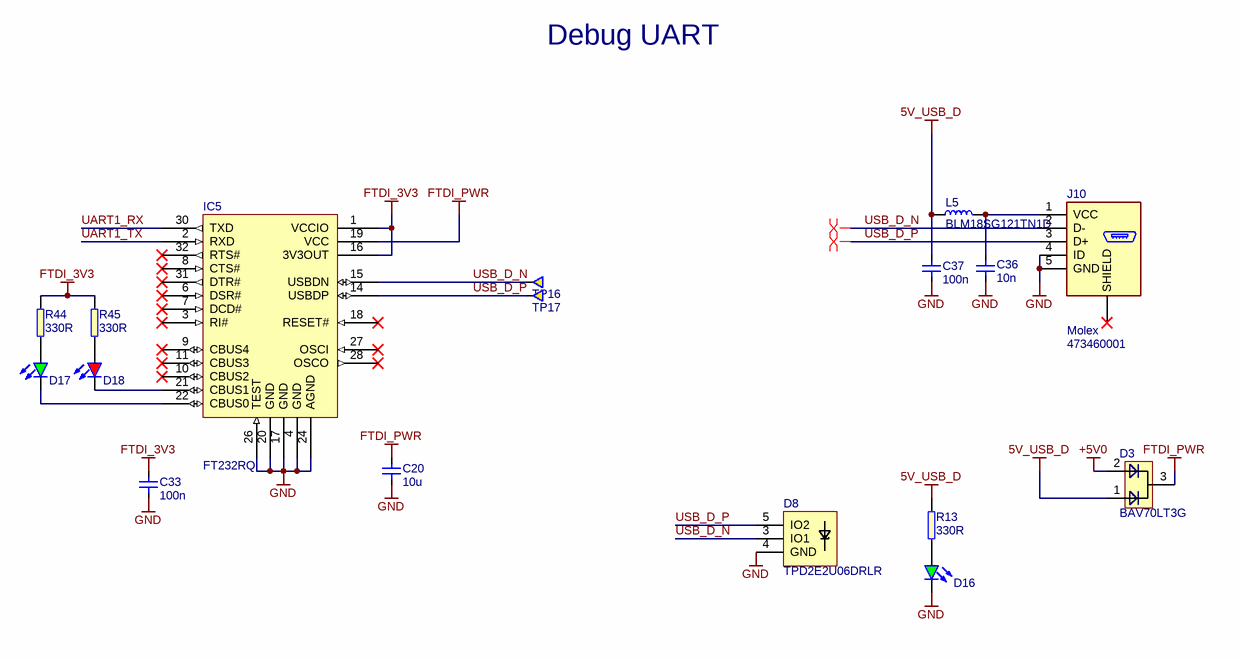
[diagram p5: Debug-UART.SchDoc]

### Parts
C20  10u  [0402]
C33  100n  [0402]
C36  10n  [0402]
C37  100n  [0402]
D3  BAV70LT3G  [SOT-23]
D8  TPD2E2U06DRLR  [TPD2E2U06DRLR]
D16  KPT-1608SGC  [LED0603]  (value not drawn)
D17  KPT-1608SGC  [LED0603]  (value not drawn)
D18  KPT-1608EC  [LED0603]  (value not drawn)
IC5  FT232RQ  [QFN-32]
J10  Manufacturer: Molex  Part Symbol: 473460001  [CON-Molex-047346-0001]  (hidden comment: Molex 47346-0001)
L5  BLM18SG121TN1D  [0603]
R13  330R  [0402]
R44  330R  [0402]
R45  330R  [0402]
TP16  TP-R-1.5  [TP-R-1.5]  (value not drawn)  (no BOM)
TP17  TP-R-1.5  [TP-R-1.5]  (value not drawn)  (no BOM)

### Nets
5V_USB_D: C37.2 D3.1 L5.1 R13.2
+5V0: D3.2
FTDI_3V3: C33.2 IC5.1(VCCIO) IC5.16(3V3OUT) R44.2 R45.2
FTDI_PWR: C20.2 D3.3 IC5.19(VCC)
GND: C20.1 C33.1 C36.2 C37.1 D8.4(GND) D16.K IC5.4(GND) IC5.17(GND) IC5.20(GND) IC5.24(AGND) IC5.26(TEST) J10.4(ID) J10.5(GND)
UART1_RX: IC5.30(TXD)
UART1_TX: IC5.2(RXD)
USB_D_N: D8.3(IO1) IC5.15(USBDN) J10.2(D-) TP16.1
USB_D_P: D8.5(IO2) IC5.14(USBDP) J10.3(D+) TP17.1
NetC36_1: C36.1 J10.1(VCC) L5.2
NetD16_A: D16.A R13.1
NetD17_A: D17.A R44.1
NetD17_K: D17.K IC5.22(CBUS0)
NetD18_A: D18.A R45.1
NetD18_K: D18.K IC5.21(CBUS1)

Not connected (* = marked no-connect by the designer): IC5 3(RI#)* 6(DSR#)* 7(DCD#)* 8(CTS#)* 9(CBUS4)* 10(CBUS2)* 11(CBUS3)* 18(RESET#)* 27(OSCI)* 28(OSCO)* 31(DTR#)* 32(RTS#)*; J10 S(SHIELD)*

### Layout directives
differential pair: USB_D_N, USB_D_P

### Notes on the sheet
- Debug UART
- Title:
- Size:
- Date:
- A3
- Revision:
- Page:
- of
- Antmicro Ltd.
- File:
- www.antmicro.com

### Library data of the parts
C20 = C_10u_0402: MLCC SMT Capacitor 10uF 0402; Manufacturer: TDK; Part Symbol: C1005X5R0J106M050BC; Value: 10u; Part Number: C_10u_0402; MPN: C1005X5R0J106M050BC
C33 C37 = C_100n_0402: as C34 on sheet Power-Supply; Value: 100n; Part Number: C_100n_0402; MPN: C1005X5R0J104K050BA
C36 = C_10n_0402: as C13 on sheet Power-Supply; Value: 10n; Part Number: C_10n_0402; MPN: 04025G103ZAT2A
D3 = BAV70LT3G: Dual switching diode, common cathode; Manufacturer: ON SEMICONDUCTOR; Part Number: BAV70LT3G; Value: BAV70LT3G; Part Symbol: BAV70LT3G; MPN: BAV70LT3G
D8 = TPD2E2U06: ESD Suppressors 2-CH; Manufacturer: Texas Instruments; Part Number: TPD2E2U06; Value: TPD2E2U06DRLR; Part Symbol: TPD2E2U06DRLR; MPN: TPD2E2U06DRLR
D16 D17 = LED_G: as D4 on sheet SoM-Supply; Part Number: LED_G; Value: KPT-1608SGC; Part Symbol: KPT-1608SGC; MPN: KPT-1608SGC
D18 = LED_R: LED Red 0603 case; Manufacturer: KINGBRIGHT; Part Number: LED_R; Value: KPT-1608EC; Part Symbol: KPT-1608EC; MPN: KPT-1608EC
IC5 = FT232RQ: USB to serial UART interface; Manufacturer: FTDI; Part Symbol: FT232RQ-REEL; Part Number: FT232RQ; Value: FT232RQ; MPN: FT232RQ-REEL
J10 = Micro USB B: USB - micro B Receptacle Connector 5 Position Surface Mount, Right Angle, Horizontal; Part Number: CON-Molex-47346-0001; Value: Molex 47346-0001; MPN: 473460001
L5 = BLM18SG121TN1D: as L4 on sheet SoM-Supply; Part Number: BLM18SG121TN1D; Value: BLM18SG121TN1D; Part Symbol: BLM18SG121TN1D; MPN: BLM18SG121TN1D
R13 R44 R45 = R_330R_0402: as R11 on sheet SoM-Supply; Value: 330R; Part Number: R_330R_0402; MPN: MCMR04X3300FTL
TP16 TP17 = TP-R-1.5: Testpad, round, 1.5mm; Part Number: TP-R-1.5

## Sheet Camera-Interface.SchDoc
size A3; DocumentNumber: 7; SheetNumber: 7; SheetTotal: 9; PageSetup: Record=PageOptions|CenterHorizontal=True|CenterVertical=True|PrintScale=0.97|XCorrection=1.00|YCorrection=1.00|PrintKind=1|BorderSize=5000000|LeftOffset=0|BottomOffset=0|Orientation=2|PaperLength=2970|PaperWidth=2100|Scale=100|PaperSource=7|PrintQuality=600|MediaType=1|DitherType=10|PaperKind=A4|PrintScaleMode=1
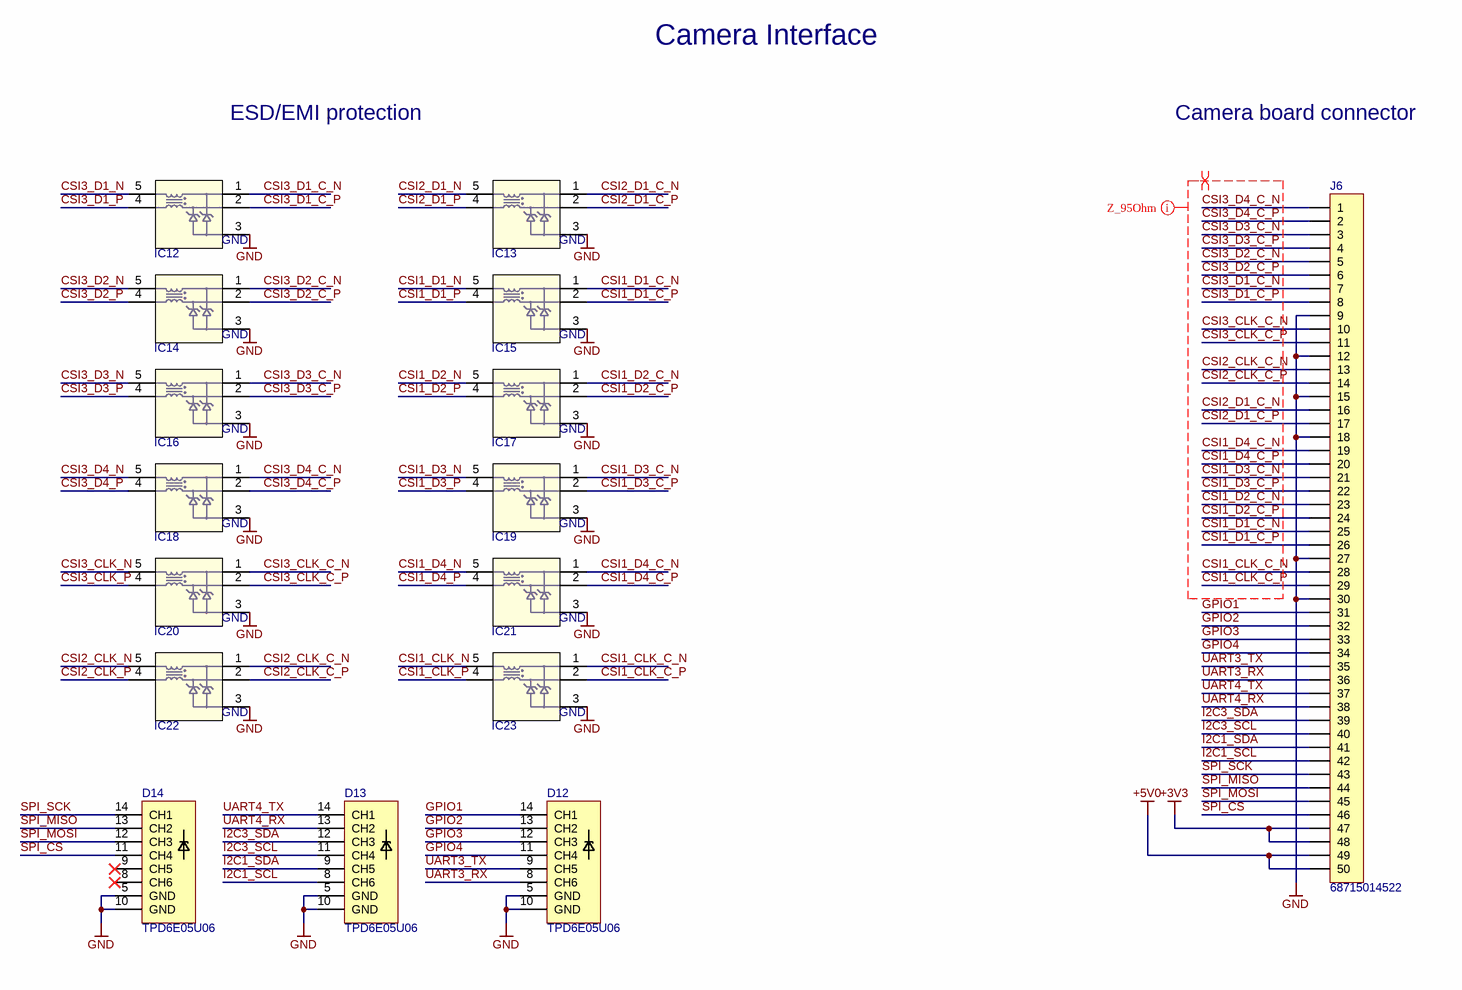
[diagram p6: Camera-Interface.SchDoc]

### Parts
D12  TPD6E05U06  [TPD6E05U06_PASS]
D13  TPD6E05U06  [TPD6E05U06_PASS]
D14  TPD6E05U06  [TPD6E05U06_PASS]
IC12  EClamp8052P  [SGP1917N5]  (value not drawn)
IC13  EClamp8052P  [SGP1917N5]  (value not drawn)
IC14  EClamp8052P  [SGP1917N5]  (value not drawn)
IC15  EClamp8052P  [SGP1917N5]  (value not drawn)
IC16  EClamp8052P  [SGP1917N5]  (value not drawn)
IC17  EClamp8052P  [SGP1917N5]  (value not drawn)
IC18  EClamp8052P  [SGP1917N5]  (value not drawn)
IC19  EClamp8052P  [SGP1917N5]  (value not drawn)
IC20  EClamp8052P  [SGP1917N5]  (value not drawn)
IC21  EClamp8052P  [SGP1917N5]  (value not drawn)
IC22  EClamp8052P  [SGP1917N5]  (value not drawn)
IC23  EClamp8052P  [SGP1917N5]  (value not drawn)
J6  68715014522  [68715014522]

### Nets
+3V3: J6.47 J6.48
+5V0: J6.49 J6.50
GND: D12.5(GND) D12.10(GND) D13.5(GND) D13.10(GND) D14.5(GND) D14.10(GND) IC12.3(GND) IC13.3(GND) IC14.3(GND) IC15.3(GND) IC16.3(GND) IC17.3(GND) IC18.3(GND) IC19.3(GND) IC20.3(GND) IC21.3(GND) IC22.3(GND) IC23.3(GND) J6.9 J6.12 J6.15 J6.18 J6.27 J6.30
CSI1_CLK_C_N: IC23.1 J6.28
CSI1_CLK_C_P: IC23.2 J6.29
CSI1_CLK_N: IC23.5
CSI1_CLK_P: IC23.4
CSI1_D1_C_N: IC15.1 J6.25
CSI1_D1_C_P: IC15.2 J6.26
CSI1_D1_N: IC15.5
CSI1_D1_P: IC15.4
CSI1_D2_C_N: IC17.1 J6.23
CSI1_D2_C_P: IC17.2 J6.24
CSI1_D2_N: IC17.5
CSI1_D2_P: IC17.4
CSI1_D3_C_N: IC19.1 J6.21
CSI1_D3_C_P: IC19.2 J6.22
CSI1_D3_N: IC19.5
CSI1_D3_P: IC19.4
CSI1_D4_C_N: IC21.1 J6.19
CSI1_D4_C_P: IC21.2 J6.20
CSI1_D4_N: IC21.5
CSI1_D4_P: IC21.4
CSI2_CLK_C_N: IC22.1 J6.13
CSI2_CLK_C_P: IC22.2 J6.14
CSI2_CLK_N: IC22.5
CSI2_CLK_P: IC22.4
CSI2_D1_C_N: IC13.1 J6.16
CSI2_D1_C_P: IC13.2 J6.17
CSI2_D1_N: IC13.5
CSI2_D1_P: IC13.4
CSI3_CLK_C_N: IC20.1 J6.10
CSI3_CLK_C_P: IC20.2 J6.11
CSI3_CLK_N: IC20.5
CSI3_CLK_P: IC20.4
CSI3_D1_C_N: IC12.1 J6.7
CSI3_D1_C_P: IC12.2 J6.8
CSI3_D1_N: IC12.5
CSI3_D1_P: IC12.4
CSI3_D2_C_N: IC14.1 J6.5
CSI3_D2_C_P: IC14.2 J6.6
CSI3_D2_N: IC14.5
CSI3_D2_P: IC14.4
CSI3_D3_C_N: IC16.1 J6.3
CSI3_D3_C_P: IC16.2 J6.4
CSI3_D3_N: IC16.5
CSI3_D3_P: IC16.4
CSI3_D4_C_N: IC18.1 J6.1
CSI3_D4_C_P: IC18.2 J6.2
CSI3_D4_N: IC18.5
CSI3_D4_P: IC18.4
GPIO1: D12.14(CH1) J6.31
GPIO2: D12.13(CH2) J6.32
GPIO3: D12.12(CH3) J6.33
GPIO4: D12.11(CH4) J6.34
I2C1_SCL: D13.8(CH6) J6.42
I2C1_SDA: D13.9(CH5) J6.41
I2C3_SCL: D13.11(CH4) J6.40
I2C3_SDA: D13.12(CH3) J6.39
SPI_CS: D14.11(CH4) J6.46
SPI_MISO: D14.13(CH2) J6.44
SPI_MOSI: D14.12(CH3) J6.45
SPI_SCK: D14.14(CH1) J6.43
UART3_RX: D12.8(CH6) J6.36
UART3_TX: D12.9(CH5) J6.35
UART4_RX: D13.13(CH2) J6.38
UART4_TX: D13.14(CH1) J6.37

Not connected (* = marked no-connect by the designer): D14 8(CH6)* 9(CH5)*

### Layout directives
differential pair: CSI1_CLK_C_N, CSI1_CLK_C_P, CSI1_D1_C_N, CSI1_D1_C_P, CSI1_D2_C_N, CSI1_D2_C_P, CSI1_D3_C_N, CSI1_D3_C_P, CSI1_D4_C_N, CSI1_D4_C_P, CSI2_CLK_C_N, CSI2_CLK_C_P, CSI2_D1_C_N, CSI2_D1_C_P, CSI3_CLK_C_N, CSI3_CLK_C_P, CSI3_D1_C_N, CSI3_D1_C_P, CSI3_D2_C_N, CSI3_D2_C_P, CSI3_D3_C_N, CSI3_D3_C_P, CSI3_D4_C_N, CSI3_D4_C_P
net class Z_95Ohm: CSI1_CLK_C_N, CSI1_CLK_C_P, CSI1_D1_C_N, CSI1_D1_C_P, CSI1_D2_C_N, CSI1_D2_C_P, CSI1_D3_C_N, CSI1_D3_C_P, CSI1_D4_C_N, CSI1_D4_C_P, CSI2_CLK_C_N, CSI2_CLK_C_P, CSI2_D1_C_N, CSI2_D1_C_P, CSI3_CLK_C_N, CSI3_CLK_C_P, CSI3_D1_C_N, CSI3_D1_C_P, CSI3_D2_C_N, CSI3_D2_C_P, CSI3_D3_C_N, CSI3_D3_C_P, CSI3_D4_C_N, CSI3_D4_C_P

### Notes on the sheet
- Camera Interface
- ESD/EMI protection
- Camera board connector
- Title:
- Size:
- Date:
- A3
- Revision:
- Page:
- of
- Antmicro Ltd.
- File:
- www.antmicro.com

### Library data of the parts
D12-D14 = TPD6E05U06_PASS: ESD Suppressors 6-CH Pass through layout; Manufacturer: Texas Instruments; Part Symbol: TPD6E05U06RVZR; Part Number: TPD6E05U06_PASS; Value: TPD6E05U06; MPN: TPD6E05U06RVZR
IC12-IC23 = EClamp8052P: 2-Line Common Mode Filter and Low Capacitance ESD Protection for MIPI USB; Manufacturer: SEMTECH; Part Symbol: ECLAMP8052P.TCT; Part Number: EClamp8052P; Value: EClamp8052P; MPN: ECLAMP8052P.TCT
J6 = 1X50: 0.50mm SMT ZIF Horizontal Bottom Contact WR-FPC; Manufacturer: WURTH ELEKTRONIK; Part Number: WE-687-150-145-22; Value: 68715014522; Part Symbol: 68715014522; MPN: 68715014522

## Sheet Peripherals.SchDoc
size A3; DocumentNumber: 8; SheetNumber: 8; SheetTotal: 9; PageSetup: Record=PageOptions|CenterHorizontal=True|CenterVertical=True|PrintScale=0.97|XCorrection=1.00|YCorrection=1.00|PrintKind=1|BorderSize=5000000|LeftOffset=0|BottomOffset=0|Orientation=2|PaperLength=2970|PaperWidth=2100|Scale=100|PaperSource=7|PrintQuality=600|MediaType=1|DitherType=10|PaperKind=A4|PrintScaleMode=1
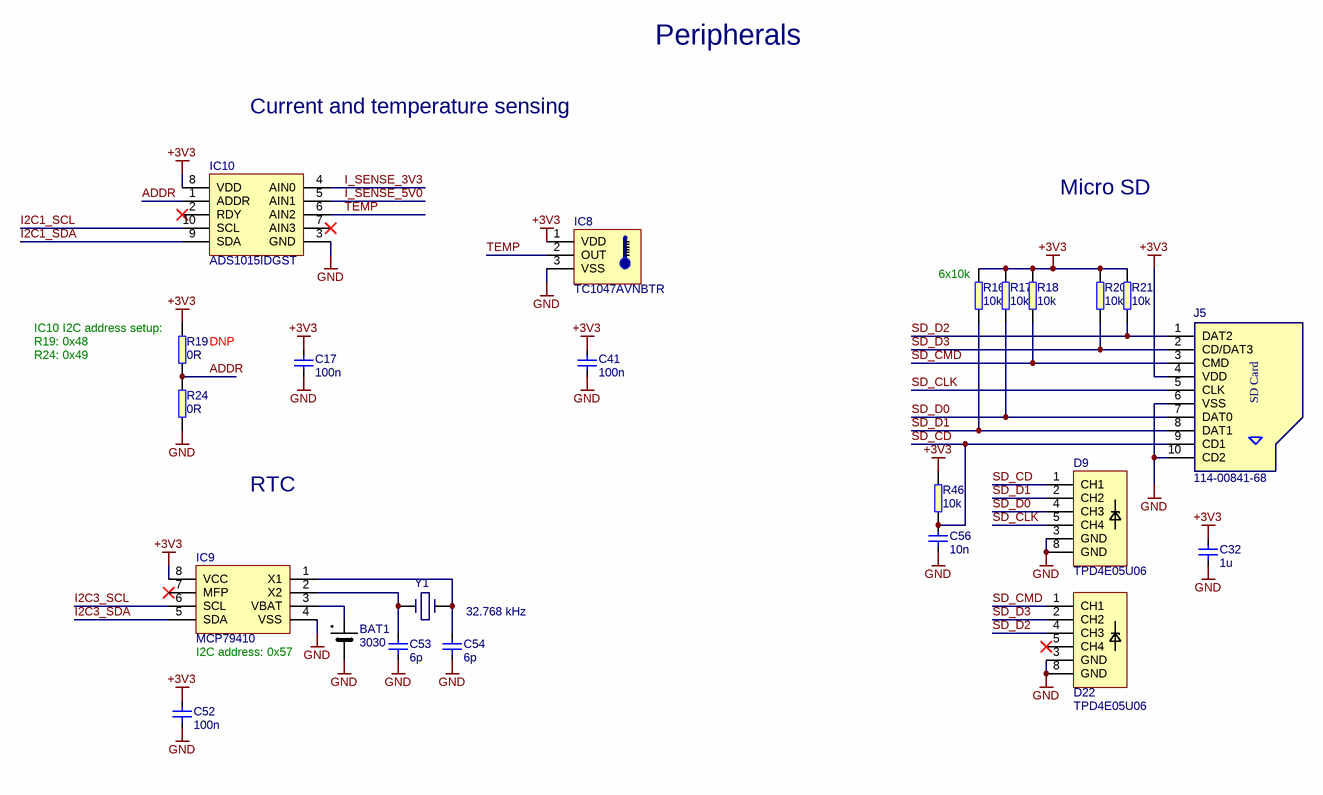
[diagram p7: Peripherals.SchDoc]

### Parts
BAT1  3030  [KEYSTONE_CR1025]
C17  100n  [0402]
C32  1u  [0402]
C41  100n  [0402]
C52  100n  [0402]
C53  6p  [0402]
C54  6p  [0402]
C56  10n  [0402]
D9  TPD4E05U06  [TPD4E05U06_PASS]
D22  TPD4E05U06  [TPD4E05U06_PASS]
IC8  TC1047AVNBTR  [SOT-23]
IC9  MCP79410  [SOIC-8]
IC10  ADS1015IDGST  [MSOP10]
J5  114-00841-68  [114-00841-68]
R16  10k  [0402]
R17  10k  [0402]
R18  10k  [0402]
R19  0R  [0603]
R20  10k  [0402]
R21  10k  [0402]
R24  0R  [0603]
R46  10k  [0402]
Y1  32.768 kHz  [ABS25]

### Nets
+3V3: C17.1 C32.2 C41.1 C52.2 IC8.1(VDD) IC9.8(VCC) IC10.8(VDD) J5.4(VDD) R16.2 R17.2 R18.2 R19.2 R20.2 R21.2 R46.2
GND: BAT1.- C17.2 C32.1 C41.2 C52.1 C53.1 C54.1 C56.1 D9.3(GND) D9.8(GND) D22.3(GND) D22.8(GND) IC8.3(VSS) IC9.4(VSS) IC10.3(GND) J5.6(VSS) J5.10(CD2) R24.1
ADDR: IC10.1(ADDR) R19.1 R24.2
I2C1_SCL: IC10.10(SCL)
I2C1_SDA: IC10.9(SDA)
I2C3_SCL: IC9.6(SCL)
I2C3_SDA: IC9.5(SDA)
I_SENSE_3V3: IC10.4(AIN0)
I_SENSE_5V0: IC10.5(AIN1)
SD_CD: C56.2 D9.1(CH1) J5.9(CD1) R46.1
SD_CLK: D9.5(CH4) J5.5(CLK)
SD_CMD: D22.1(CH1) J5.3(CMD) R18.1
SD_D0: D9.4(CH3) J5.7(DAT0) R17.1
SD_D1: D9.2(CH2) J5.8(DAT1) R16.1
SD_D2: D22.4(CH3) J5.1(DAT2) R21.1
SD_D3: D22.2(CH2) J5.2(CD/DAT3) R20.1
TEMP: IC8.2(OUT) IC10.6(AIN2)
NetBAT1_+: BAT1.+ IC9.3(VBAT)
NetC53_2: C53.2 IC9.2(X2) Y1.2
NetC54_2: C54.2 IC9.1(X1) Y1.1

Not connected (* = marked no-connect by the designer): D22 5(CH4)*; IC9 7(MFP)*; IC10 2(RDY)* 7(AIN3)*

### Notes on the sheet
- Peripherals
- Current and temperature sensing
- Micro SD
- (near R19) IC10 I2C address setup:
- (near R16) 6x10k
- R19: 0x48
- R24: 0x49
- (near R19) DNP
- RTC
- (near IC9) I2C address: 0x57
- Title:
- Size:
- Date:
- A3
- Revision:
- Page:
- of
- Antmicro Ltd.
- File:
- www.antmicro.com
- (in symbol Micro_SD) SD Card

### Library data of the parts
BAT1 = battery: SMT holder for  CR1025 battery; Manufacturer: Keystone; Part Number: Keystone_CR1025; Value: 3030; Part Symbol: 3030; MPN: 3030
C17 C41 C52 = C_100n_0402: as C34 on sheet Power-Supply; Value: 100n; Part Number: C_100n_0402; MPN: C1005X5R0J104K050BA
C32 = C_1u_0402: MLCC SMT Capacitor 1uF 0402; Manufacturer: MULTICOMP; Part Symbol: MC0402F105Z6R3CT; Value: 1u; Part Number: C_1u_0402; MPN: MC0402F105Z6R3CT
C53 C54 = C_6p_0402: MLCC SMT Capacitor 6pF 0402; Manufacturer: WALSIN; Part Symbol: 0402N6R0D500CT; Value: 6p; Part Number: C_6p_0402; MPN: 0402N6R0D500CT
C56 = C_10n_0402: as C13 on sheet Power-Supply; Value: 10n; Part Number: C_10n_0402; MPN: 04025G103ZAT2A
D9 D22 = TPD4E05U06_PASS: ESD Suppressors 4-CH; Manufacturer: Texas Instruments; Part Symbol: TPD4E05U06DQAR; Part Number: TPD4E05U06_PASS; Value: TPD4E05U06; MPN: TPD4E05U06DQAR
IC8 = TC1047A: Precision Temperature-to-Voltage Converter; Manufacturer: MICROCHIP; Part Number: TC1047A; Value: TC1047AVNBTR; Part Symbol: TC1047AVNBTR; MPN: TC1047AVNBTR
IC9 = MCP79410: RTC timer with EEPROM and I2C interface; Manufacturer: MICROCHIP; Part Symbol: MCP79410-I/SN; Part Number: MCP79410; Value: MCP79410; MPN: MCP79410-I/SN
IC10 = ADS1015: ADC 12BIT 4CH I2C; Manufacturer: TEXAS INSTRUMENTS; Part Number: ADS1015IDGST; Value: ADS1015IDGST; Part Symbol: ADS1015IDGST; MPN: ADS1015IDGST
J5 = Micro_SD: Micro SD card holder; Part Number: AMP-114-00841-68; Manufacturer: AMPHENOL COMMERCIAL PRODUCTS; Value: 114-00841-68; Part Symbol: 114-00841-68; MPN: 114-00841-68
R16-R18 R20 R21 R46 = R_10k_0402: as R9 on sheet Power-Supply; Value: 10k; Part Number: R_10k_0402; MPN: MCMR04X1002FTL
R19 R24 = R_0R_0603: RES, 0R, 0603; Manufacturer: BOURNS; Part Symbol: CR0603-J/-000ELF; Value: 0R; Part Number: R_0R_0603; MPN: CR0603-J/-000ELF
Y1 = ABS25-32.768KHZ-6-T: CRYSTAL, 32.768KHz, 6PF, SMD; Manufacturer: ABRACON; Value: 32.768 kHz; Part Number: ABS25-32.768KHZ-6-T; Part Symbol: ABS25-32.768KHZ-6-T; MPN: ABS25-32.768KHZ-6-T

## Sheet Interfaces.SchDoc
size A3; DocumentNumber: 9; SheetNumber: 9; SheetTotal: 9; PageSetup: Record=PageOptions|CenterHorizontal=True|CenterVertical=True|PrintScale=0.97|XCorrection=1.00|YCorrection=1.00|PrintKind=1|BorderSize=5000000|LeftOffset=0|BottomOffset=0|Orientation=2|PaperLength=2970|PaperWidth=2100|Scale=100|PaperSource=7|PrintQuality=600|MediaType=1|DitherType=10|PaperKind=A4|PrintScaleMode=1
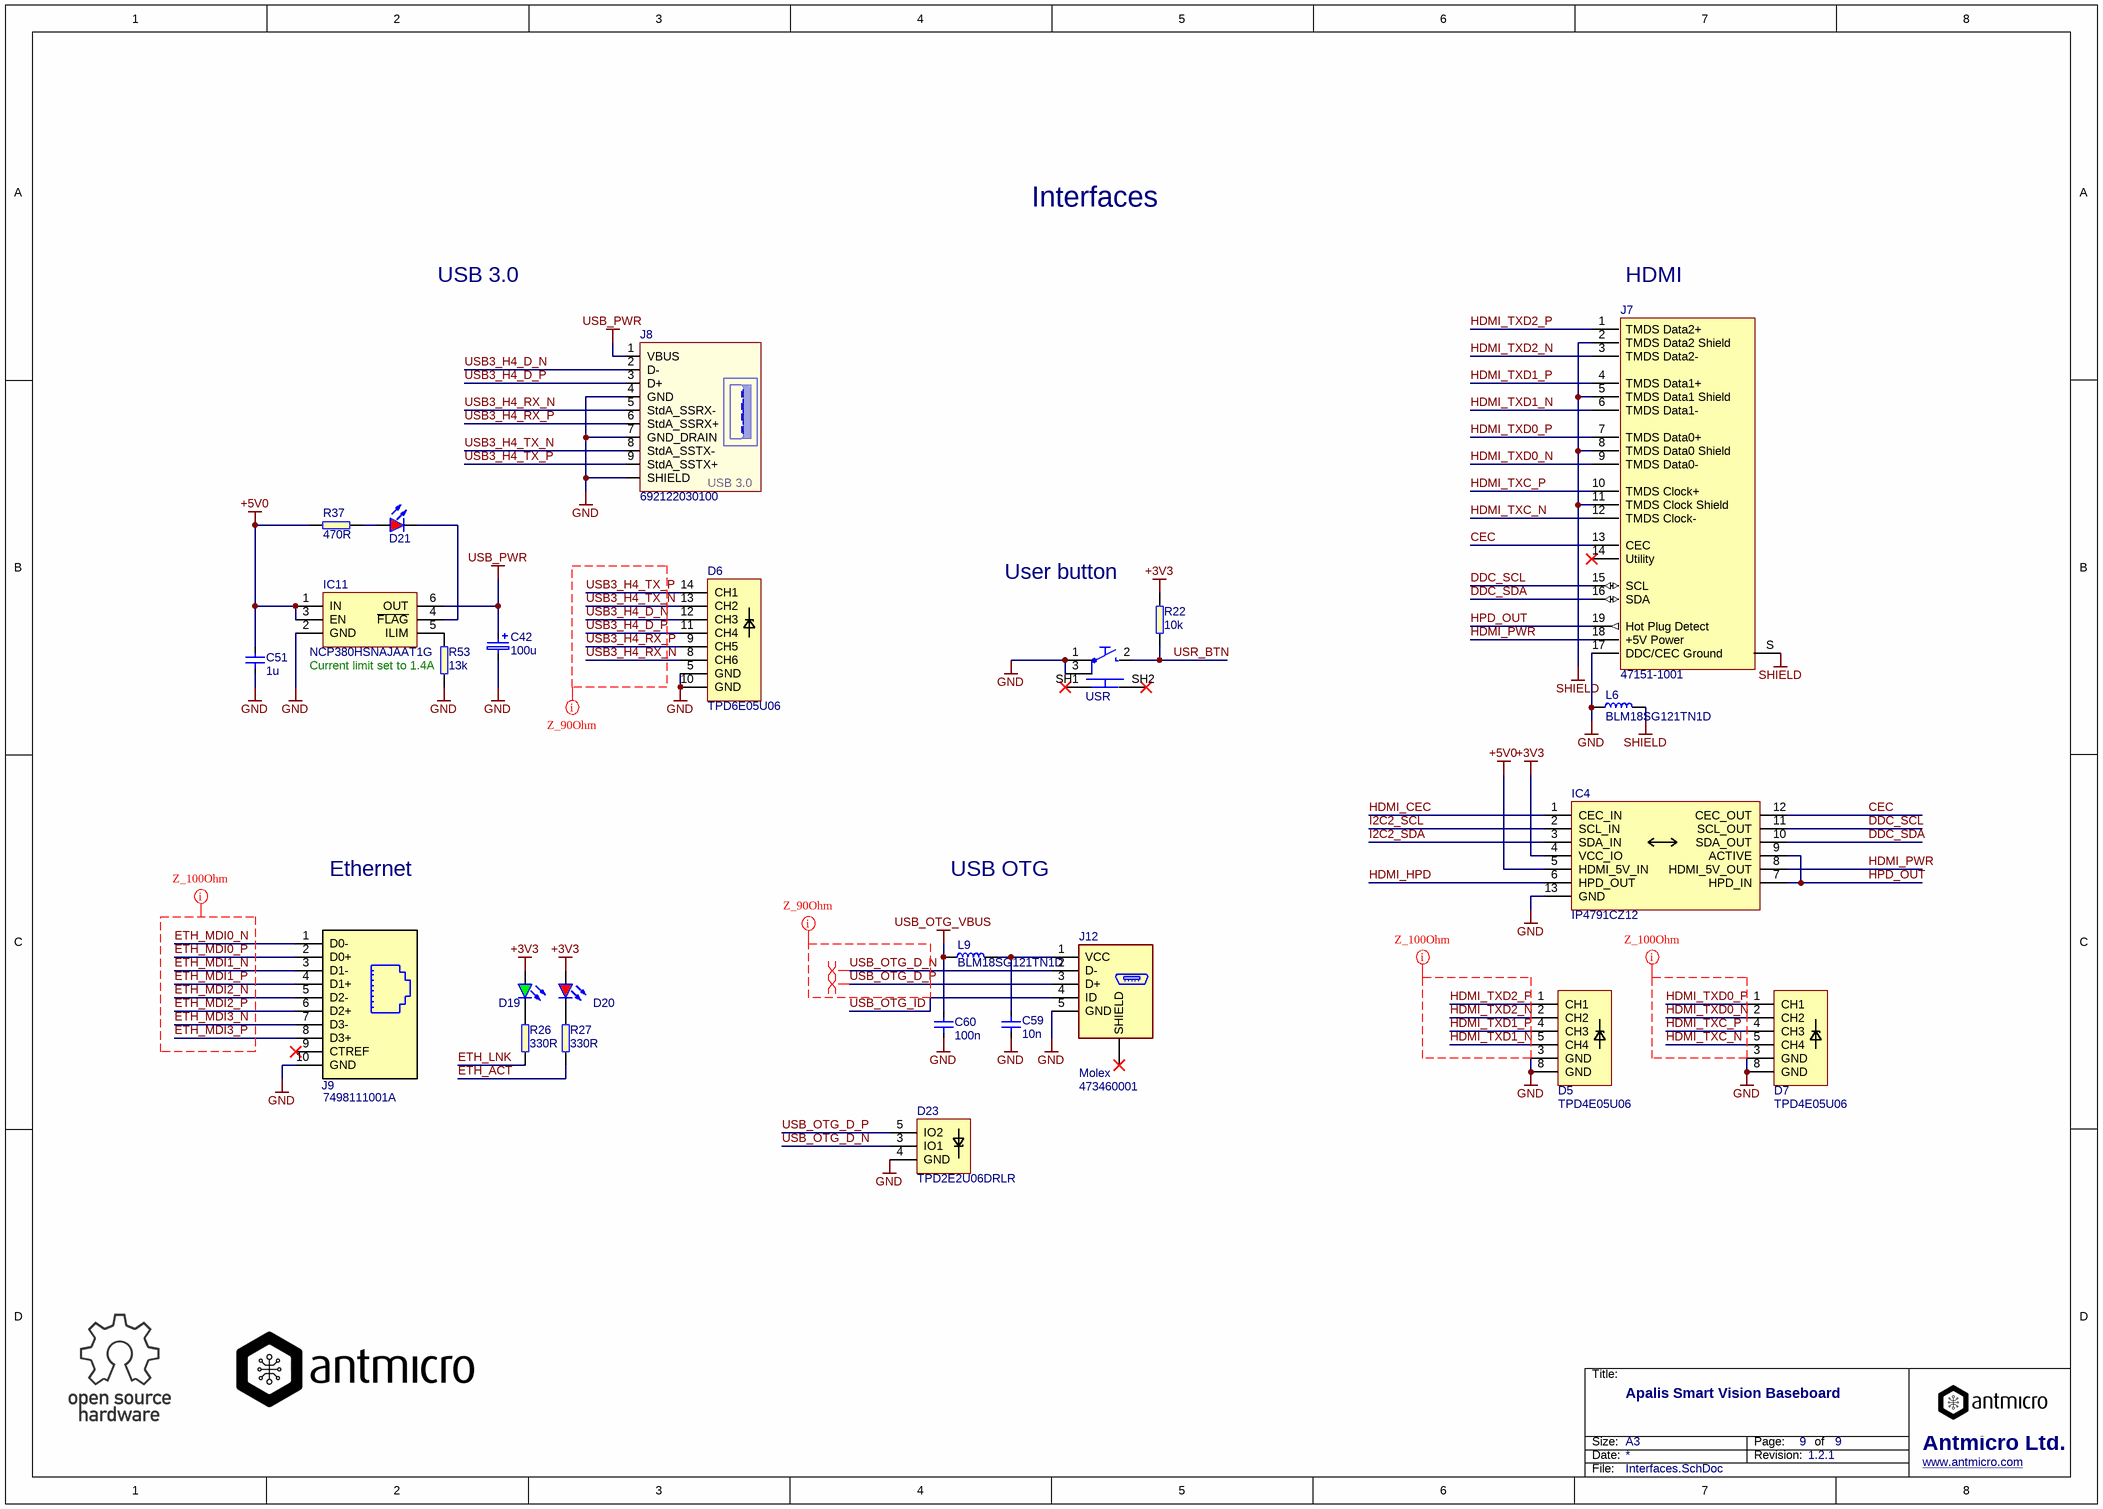
[diagram p8: Interfaces.SchDoc]

### Parts
C42  100u  [KEMET_A]
C51  1u  [0402]
C59  10n  [0402]
C60  100n  [0402]
D5  TPD4E05U06  [TPD4E05U06_PASS]
D6  TPD6E05U06  [TPD6E05U06_PASS]
D7  TPD4E05U06  [TPD4E05U06_PASS]
D19  KPJA-2107CKCK  [KPJA-2107]  (value not drawn)
D20  KPJA-2107SYCK  [KPJA-2107]  (value not drawn)
D21  KPT-1608EC  [LED0603]  (value not drawn)
D23  TPD2E2U06DRLR  [TPD2E2U06DRLR]
IC4  IP4791CZ12  [IP4791CZ12]
IC11  NCP380HSNAJAAT1G  [TSOP-6]
J7  47151-1001  [Molex_HDMI_471511001]
J8  692122030100  [692122030100]
J9  7498111001A  [7498111001A]
J12  Manufacturer: Molex  Part Symbol: 473460001  [CON-Molex-047346-0001]  (hidden comment: Molex 47346-0001)
L6  BLM18SG121TN1D  [0603]
L9  BLM18SG121TN1D  [0603]
R22  10k  [0402]
R26  330R  [0402]
R27  330R  [0402]
R37  470R  [0402]
R53  13k  [0402]
USR  TL3340AF160QG  [TL3340AF160QG]  (value not drawn)

### Nets
+3V3: D19.A D20.A IC4.4(VCC_IO) R22.2
+5V0: C51.2 IC4.5(HDMI_5V_IN) IC11.1(IN) IC11.3(EN) R37.2
GND: C42.2 C51.1 C59.2 C60.1 D5.3(GND) D5.8(GND) D6.5(GND) D6.10(GND) D7.3(GND) D7.8(GND) D23.4(GND) IC4.13(GND) IC11.2(GND) J7.17(DDC/CEC_Ground) J8.4(GND) J8.7(GND_DRAIN) J8.SHIELD J9.10(GND) J12.5(GND) L6.1 R53.1 USR.1 USR.3
SHIELD: J7.2(TMDS_Data2_Shield) J7.5(TMDS_Data1_Shield) J7.8(TMDS_Data0_Shield) J7.11(TMDS_Clock_Shield) J7.S(SH) L6.2
USB_OTG_VBUS: C60.2 L9.1
USB_PWR: C42.1 IC11.6(OUT) J8.1(VBUS)
CEC: IC4.12(CEC_OUT) J7.13(CEC)
DDC_SCL: IC4.11(SCL_OUT) J7.15(SCL)
DDC_SDA: IC4.10(SDA_OUT) J7.16(SDA)
ETH_ACT: R27.2
ETH_LNK: R26.2
ETH_MDI0_N: J9.1(D0-)
ETH_MDI0_P: J9.2(D0+)
ETH_MDI1_N: J9.3(D1-)
ETH_MDI1_P: J9.4(D1+)
ETH_MDI2_N: J9.5(D2-)
ETH_MDI2_P: J9.6(D2+)
ETH_MDI3_N: J9.7(D3-)
ETH_MDI3_P: J9.8(D3+)
HDMI_CEC: IC4.1(CEC_IN)
HDMI_HPD: IC4.6(HPD_OUT)
HDMI_PWR: IC4.8(HDMI_5V_OUT) J7.18(+5V_Power)
HDMI_TXC_N: D7.5(CH4) J7.12(TMDS_Clock-)
HDMI_TXC_P: D7.4(CH3) J7.10(TMDS_Clock+)
HDMI_TXD0_N: D7.2(CH2) J7.9(TMDS_Data0-)
HDMI_TXD0_P: D7.1(CH1) J7.7(TMDS_Data0+)
HDMI_TXD1_N: D5.5(CH4) J7.6(TMDS_Data1-)
HDMI_TXD1_P: D5.4(CH3) J7.4(TMDS_Data1+)
HDMI_TXD2_N: D5.2(CH2) J7.3(TMDS_Data2-)
HDMI_TXD2_P: D5.1(CH1) J7.1(TMDS_Data2+)
HPD_OUT: IC4.7(HPD_IN) IC4.9(ACTIVE) J7.19(Hot_Plug_Detect)
I2C2_SCL: IC4.2(SCL_IN)
I2C2_SDA: IC4.3(SDA_IN)
USB3_H4_D_N: D6.12(CH3) J8.2(D-)
USB3_H4_D_P: D6.11(CH4) J8.3(D+)
USB3_H4_RX_N: D6.8(CH6) J8.5(StdA_SSRX-)
USB3_H4_RX_P: D6.9(CH5) J8.6(StdA_SSRX+)
USB3_H4_TX_N: D6.13(CH2) J8.8(StdA_SSTX-)
USB3_H4_TX_P: D6.14(CH1) J8.9(StdA_SSTX+)
USB_OTG_D_N: D23.3(IO1) J12.2(D-)
USB_OTG_D_P: D23.5(IO2) J12.3(D+)
USB_OTG_ID: J12.4(ID)
USR_BTN: R22.1 USR.2
NetC59_1: C59.1 J12.1(VCC) L9.2
NetD19_K: D19.K R26.1
NetD20_K: D20.K R27.1
NetD21_A: D21.A R37.1
NetD21_K: D21.K IC11.4(~{FLAG})
NetIC11_5: IC11.5(ILIM) R53.2

Not connected (* = marked no-connect by the designer): J7 14(Utility)*; J9 9(CTREF)*; J12 S(SHIELD)*; USR SH1* SH2*

### Layout directives
differential pair: USB_OTG_D_N, USB_OTG_D_P
net class Z_90Ohm: USB3_H4_D_N, USB3_H4_D_P, USB3_H4_RX_N, USB3_H4_RX_P, USB3_H4_TX_N, USB3_H4_TX_P, USB_OTG_D_N, USB_OTG_D_P
net class Z_100Ohm: ETH_MDI0_N, ETH_MDI0_P, ETH_MDI1_N, ETH_MDI1_P, ETH_MDI2_N, ETH_MDI2_P, ETH_MDI3_N, ETH_MDI3_P, HDMI_TXC_N, HDMI_TXC_P, HDMI_TXD0_N, HDMI_TXD0_P, HDMI_TXD1_N, HDMI_TXD1_P, HDMI_TXD2_N, HDMI_TXD2_P

### Notes on the sheet
- Interfaces
- USB 3.0
- (near J7) HDMI
- (near R22) User button
- (near R53) Current limit set to 1.4A
- Ethernet
- USB OTG
- Title:
- Size:
- Date:
- A3
- Revision:
- Page:
- of
- Antmicro Ltd.
- File:
- www.antmicro.com
- (in symbol USB_3_A) USB 3.0

### Library data of the parts
C42 = C_100u_KEMET_A: Tantalum SMT Capacitor 100uF Case KEMET_A; Manufacturer: VISHAY; Part Symbol: 298D107X06R3A2T; Value: 100u; Part Number: C_100u_KEMET_A; MPN: 298D107X06R3A2T
C51 = C_1u_0402: as C32 on sheet Peripherals; Value: 1u; Part Number: C_1u_0402; MPN: MC0402F105Z6R3CT
C59 = C_10n_0402: as C13 on sheet Power-Supply; Value: 10n; Part Number: C_10n_0402; MPN: 04025G103ZAT2A
C60 = C_100n_0402: as C34 on sheet Power-Supply; Value: 100n; Part Number: C_100n_0402; MPN: C1005X5R0J104K050BA
D5 D7 = TPD4E05U06_PASS: as D9 on sheet Peripherals; Part Number: TPD4E05U06_PASS; Value: TPD4E05U06; MPN: TPD4E05U06DQAR
D6 = TPD6E05U06_PASS: as D12 on sheet Camera-Interface; Part Number: TPD6E05U06_PASS; Value: TPD6E05U06; MPN: TPD6E05U06RVZR
D19 = KPJA-2107CKCK: LED Green 0603 case; Part Number: LED_G; Manufacturer: KINGBRIGHT; Value: KPJA-2107CKCK; Part Symbol: KPJA-2107CKCK; MPN: KPJA-2107CKCK
D20 = KPJA-2107SYCK: LED Red 0603 case; Part Number: LED_R; Manufacturer: KINGBRIGHT; Value: KPJA-2107SYCK; Part Symbol: KPJA-2107SYCK; MPN: KPJA-2107SYCK
D21 = LED_R: as D18 on sheet Debug-UART; Part Number: LED_R; Value: KPT-1608EC; Part Symbol: KPT-1608EC; MPN: KPT-1608EC
D23 = TPD2E2U06: as D8 on sheet Debug-UART; Part Number: TPD2E2U06; Value: TPD2E2U06DRLR; Part Symbol: TPD2E2U06DRLR; MPN: TPD2E2U06DRLR
IC4 = IP4791CZ12: HDMI DEVICE, ESD PROTECTION; Manufacturer: NXP; Part Number: IP4791CZ12; Value: IP4791CZ12; Part Symbol: IP4791CZ12; MPN: IP4791CZ12
IC11 = NCP380HSNAJAAT1G: POWER LOAD SWITCH, HIGH SIDE; Manufacturer: ON Semiconductor; Part Symbol: NCP380HSNAJAAT1G; Value: NCP380HSNAJAAT1G; Part Number: NCP380HSNAJAAT1G; MPN: NCP380HSNAJAAT1G
J7 = CON-Molex-471511001: Header right angle HDMI; Manufacturer: MOLEX; Part Number: CON-Molex-471511001; Value: 47151-1001; Part Symbol: 47151-1001; MPN: 47151-1001
J8 = USB_3_A: USB 3.0 Type A Horizontal SMD WR-COM; Manufacturer: WURTH ELEKTRONIK; Part Number: WE-692-122-030-100; Value: 692122030100; Part Symbol: 692122030100; MPN: 692122030100
J9 = RJ-45-10: RJ-45 with Transofrmer, 10/100/1000 Base-T; Manufacturer: WURTH ELEKTRONIK; Part Number: WE-749-811-100-1A; Value: 7498111001A; Part Symbol: 7498111001A; MPN: 7498111001A
J12 = Micro USB B: as J10 on sheet Debug-UART; Value: Molex 47346-0001; MPN: 473460001
L6 L9 = BLM18SG121TN1D: as L4 on sheet SoM-Supply; Part Number: BLM18SG121TN1D; Value: BLM18SG121TN1D; Part Symbol: BLM18SG121TN1D; MPN: BLM18SG121TN1D
R22 = R_10k_0402: as R9 on sheet Power-Supply; Value: 10k; Part Number: R_10k_0402; MPN: MCMR04X1002FTL
R26 R27 = R_330R_0402: as R11 on sheet SoM-Supply; Value: 330R; Part Number: R_330R_0402; MPN: MCMR04X3300FTL
R37 = R_470R_0402: RES, 470R, 0402; Manufacturer: VISHAY; Part Symbol: CRCW0402470RFKED.; Value: 470R; Part Number: R_470R_0402; MPN: CRCW0402470RFKED.
R53 = R_13k_0402: RES, 13k, 0402; Manufacturer: Panasonic; Part Symbol: ERJ2GEJ133X; Value: 13k; Part Number: R_13k_0402; MPN: ERJ2GEJ133X
USR = TL3340AF160QG: as RST on sheet SoM-Supply; Part Number: TL3340AF160QG; Value: TL3340AF160QG; Manufacturer: E-SWITCH; Part Symbol: TL3340AF160QG; MPN: TL3340AF160QG